# EAGLE design csa_iecuart_v1.1a (EAGLE 6.4)

## Sheet 1 of 3
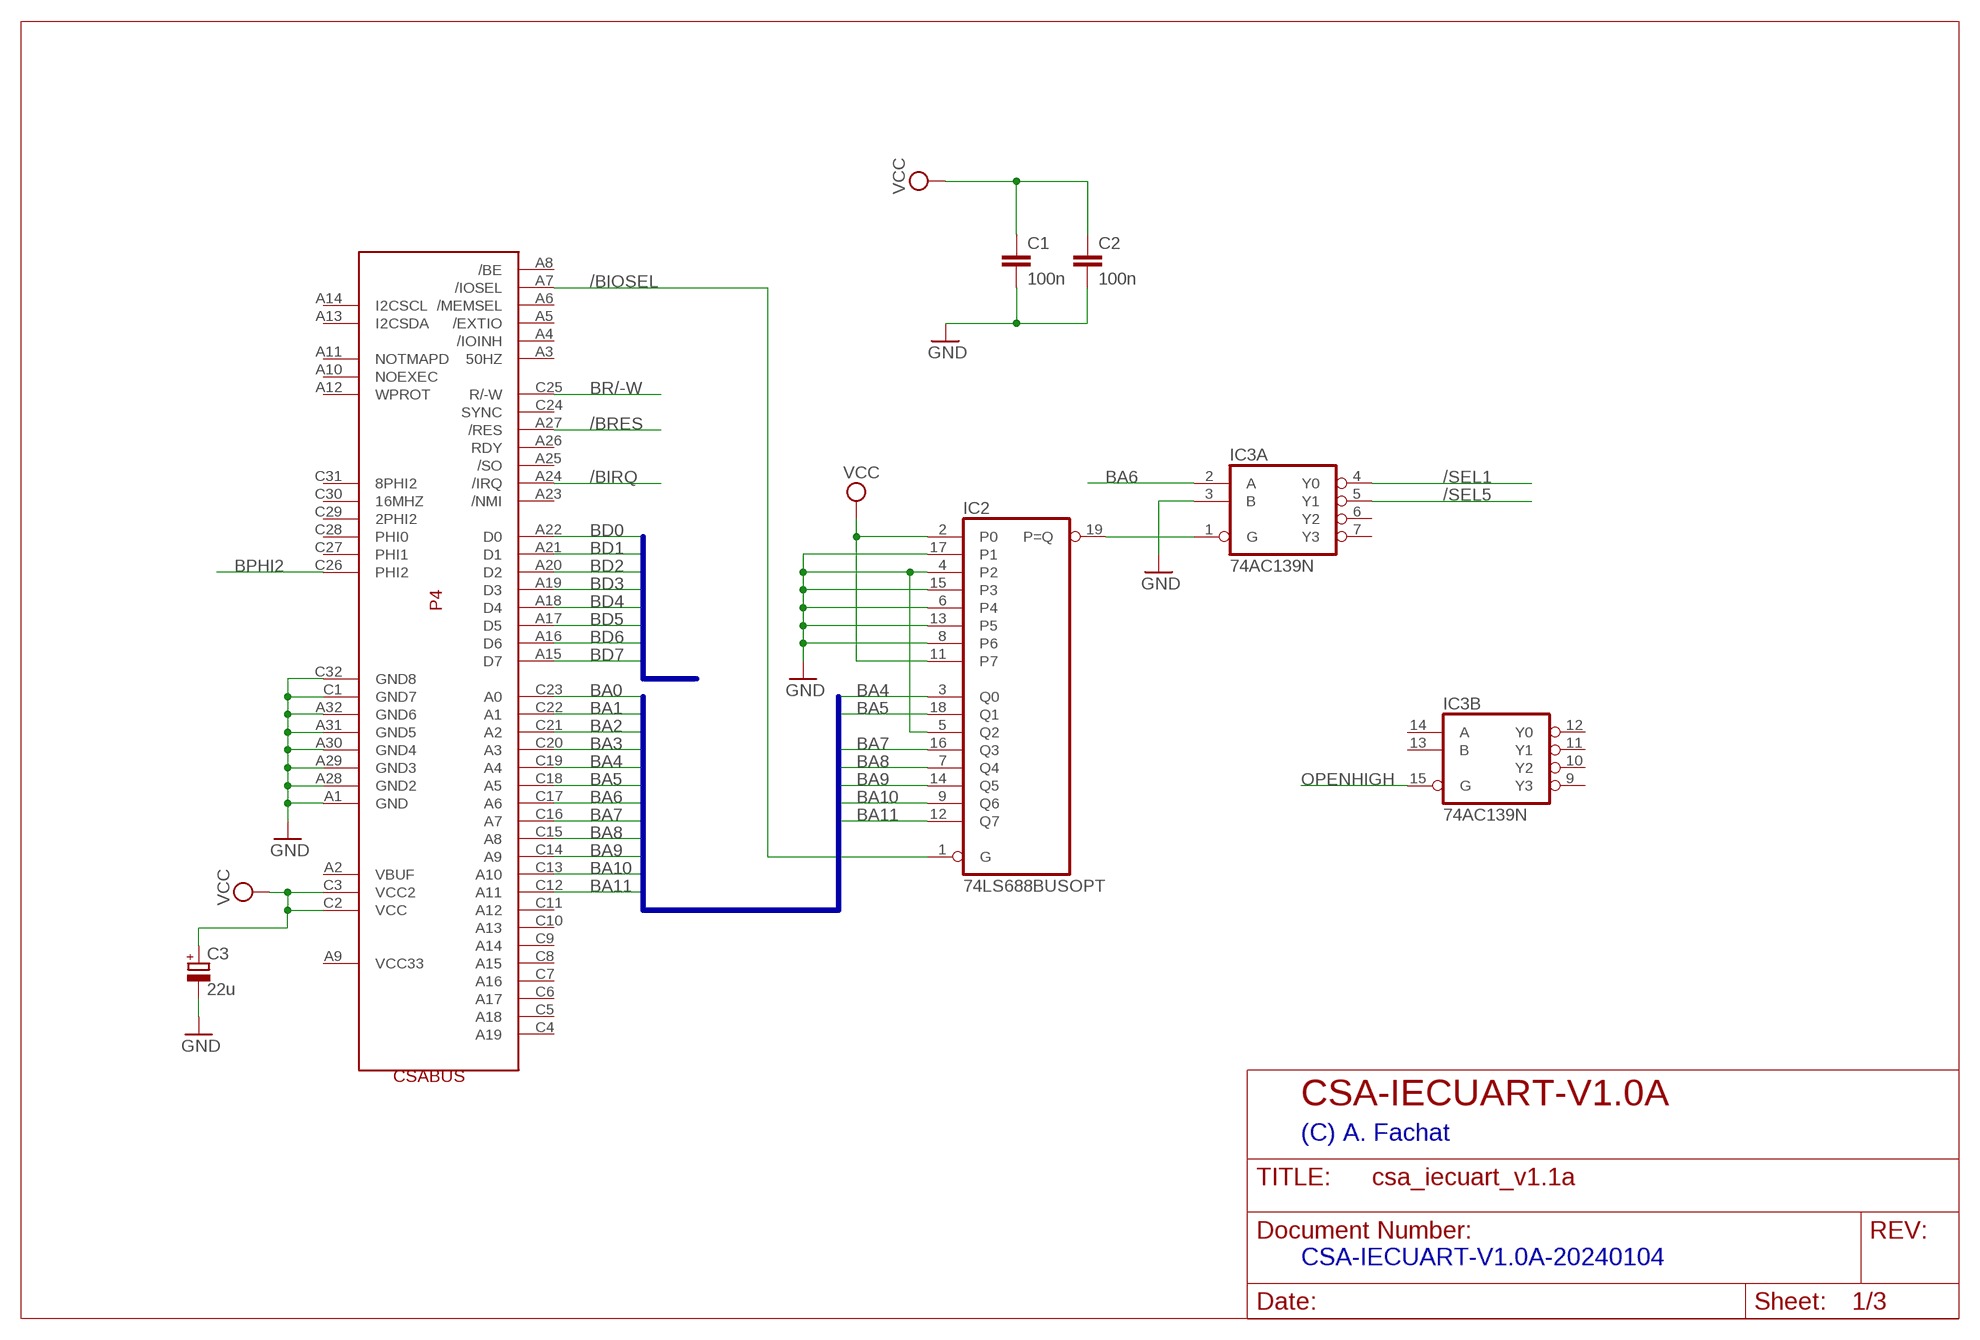
[diagram p0: schematic, sheet 1]

### Parts
C1  100n  C-EU025-024X044  [C025-024X044]
C2  100n  C-EU025-024X044  [C025-024X044]
C3  22u  CPOL-EUE2.5-7  [E2,5-7]
IC2  74LS688BUSOPT  [DIL20]
IC3  74AC139N  [DIL16]
P4  CSABUS  [CSABUS]

### Nets
/BIOSEL: IC2.1(G) P4.A7(/IOSEL)
/BIRQ: P4.A24(/IRQ) ; also sheet 2,3
/BRES: P4.A27(/RES) ; also sheet 2,3
/SEL1: IC3.4(A:Y0) ; also sheet 3
/SEL5: IC3.5(A:Y1) ; also sheet 2
BA0: P4.C23(A0) ; also sheet 2,3
BA1: P4.C22(A1) ; also sheet 2,3
BA2: P4.C21(A2) ; also sheet 2,3
BA3: P4.C20(A3) ; also sheet 2,3
BA4: IC2.3(Q0) P4.C19(A4)
BA5: IC2.18(Q1) P4.C18(A5)
BA6: IC3.2(A:A) P4.C17(A6)
BA7: IC2.16(Q3) P4.C16(A7)
BA8: IC2.7(Q4) P4.C15(A8)
BA9: IC2.14(Q5) P4.C14(A9)
BA10: IC2.9(Q6) P4.C13(A10)
BA11: IC2.12(Q7) P4.C12(A11)
BD0: P4.A22(D0) ; also sheet 2,3
BD1: P4.A21(D1) ; also sheet 2,3
BD2: P4.A20(D2) ; also sheet 2,3
BD3: P4.A19(D3) ; also sheet 2,3
BD4: P4.A18(D4) ; also sheet 2,3
BD5: P4.A17(D5) ; also sheet 2,3
BD6: P4.A16(D6) ; also sheet 2,3
BD7: P4.A15(D7) ; also sheet 2,3
BPHI2: P4.C26(PHI2) ; also sheet 2,3
BR/-W: P4.C25(R/-W) ; also sheet 2,3
GND: C1.2 C2.2 C3.- IC2.4(P2) IC2.5(Q2) IC2.6(P4) IC2.8(P6) IC2.13(P5) IC2.15(P3) IC2.17(P1) IC3.3(A:B) P4.A1(GND) P4.A28(GND2) P4.A29(GND3) P4.A30(GND4) P4.A31(GND5) P4.A32(GND6) P4.C1(GND7) P4.C32(GND8) ; also sheet 2,3
N$3: IC2.19(P=Q) IC3.1(A:G)
OPENHIGH: IC3.15(B:G) ; also sheet 2,3
VCC: C1.1 C2.1 C3.+ IC2.2(P0) IC2.11(P7) P4.C2(VCC) P4.C3(VCC2) ; also sheet 2,3
Unconnected: IC3.6(A:Y2) IC3.7(A:Y3) IC3.9(B:Y3) IC3.10(B:Y2) IC3.11(B:Y1) IC3.12(B:Y0) IC3.13(B:B) IC3.14(B:A) P4.A2(VBUF) P4.A3(50HZ) P4.A4(/IOINH) P4.A5(/EXTIO) P4.A6(/MEMSEL) P4.A8(/BE) P4.A9(VCC33) P4.A10(NOEXEC) P4.A11(NOTMAPD) P4.A12(WPROT) P4.A13(I2CSDA) P4.A14(I2CSCL) P4.A23(/NMI) P4.A25(/SO) P4.A26(RDY) P4.C4(A19) P4.C5(A18) P4.C6(A17) P4.C7(A16) P4.C8(A15) P4.C9(A14) P4.C10(A13) P4.C11(A12) P4.C24(SYNC) P4.C27(PHI1) P4.C28(PHI0) P4.C29(2PHI2) P4.C30(16MHZ) P4.C31(8PHI2)

### Buses
BD[0..7]
BA[0..11]

### Notes on the sheet
- CSA-IECUART-V1.0A
- (C) A. Fachat
- CSA-IECUART-V1.0A-20240104

## Sheet 2 of 3: Fast IEC
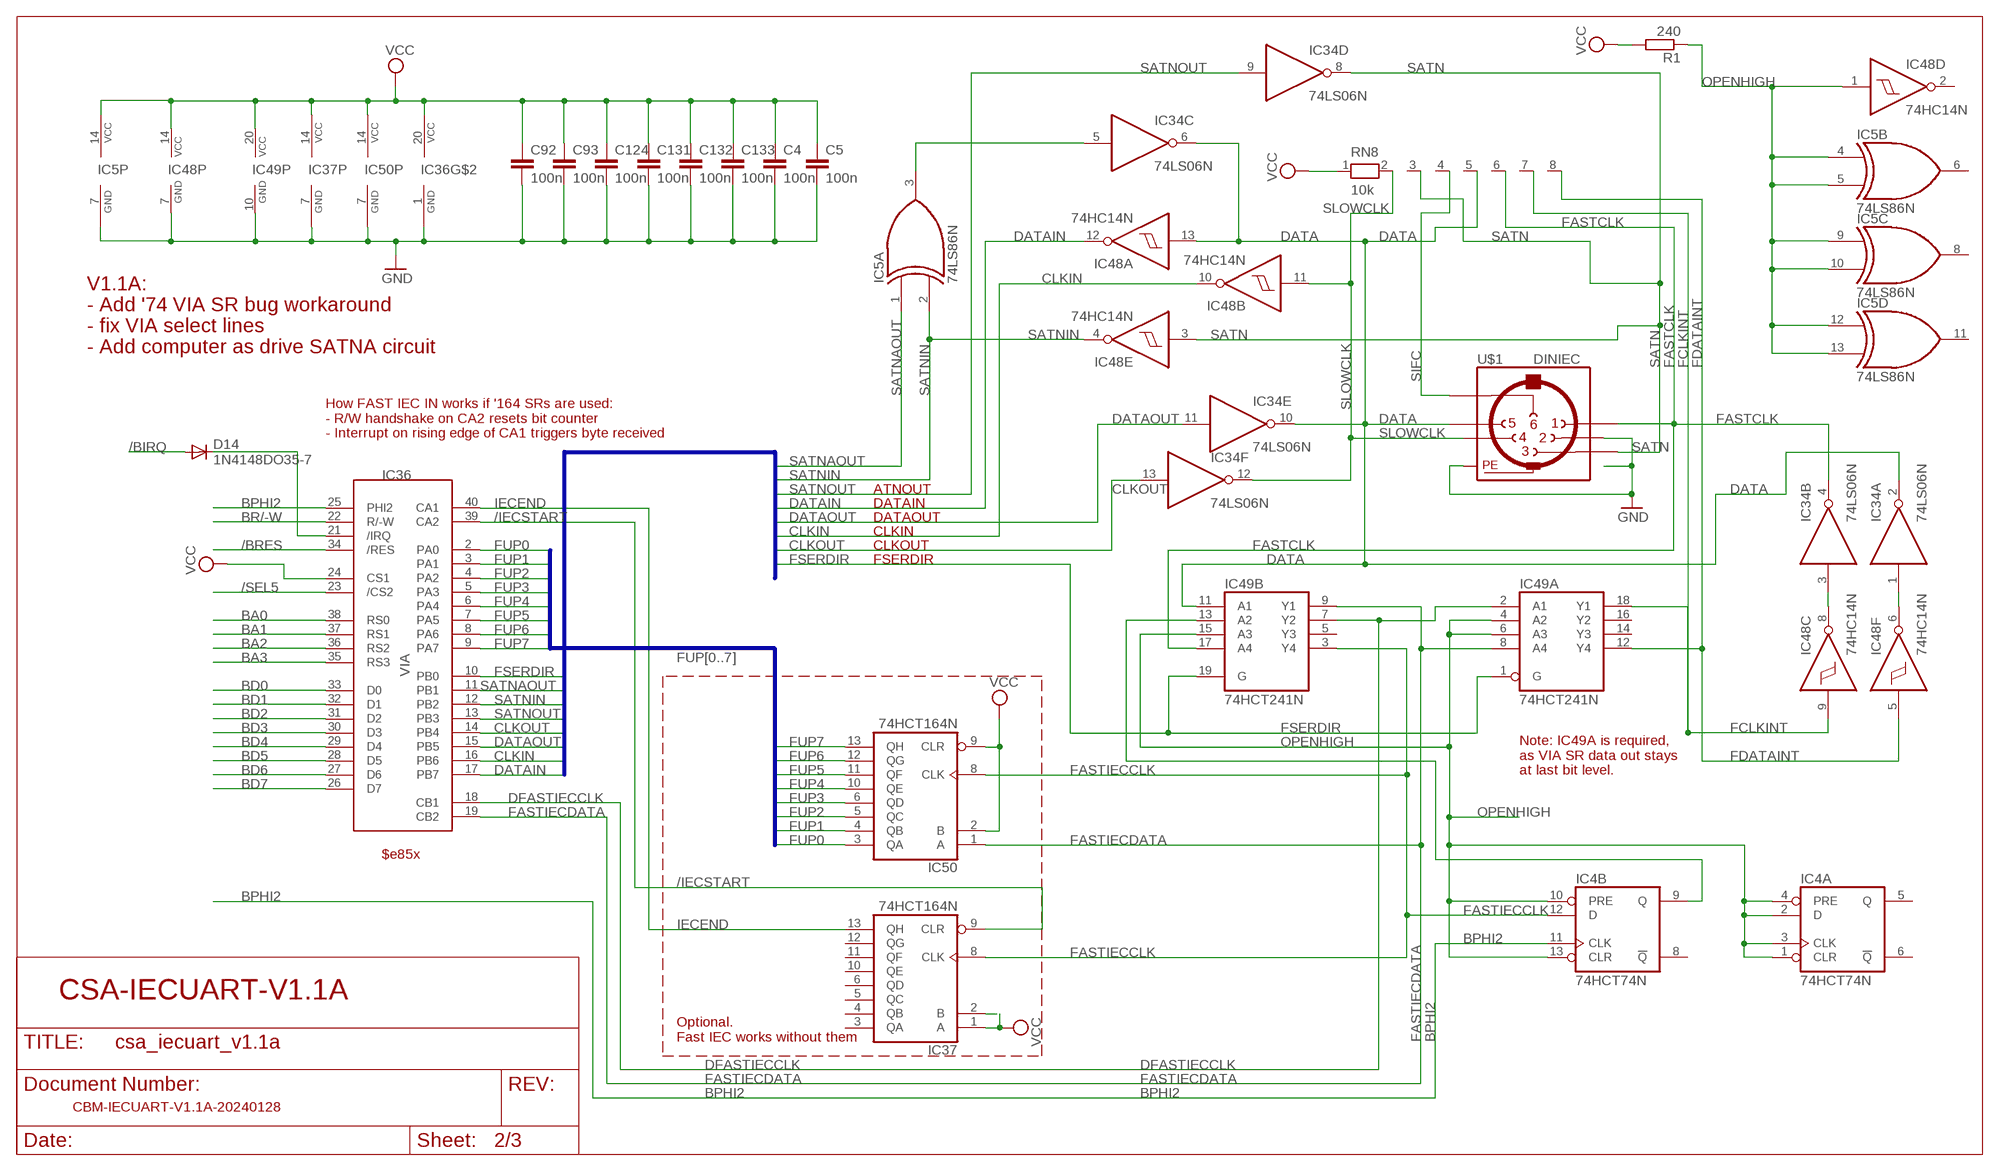
[diagram p1: schematic, sheet 2]

### Parts
C4  100n  C-EU025-024X044  [C025-024X044]
C5  100n  C-EU025-024X044  [C025-024X044]
C92  100n  C-EU025-024X044  [C025-024X044]
C93  100n  C-EU025-024X044  [C025-024X044]
C124  100n  C-EU025-024X044  [C025-024X044]
C131  100n  C-EU025-024X044  [C025-024X044]
C132  100n  C-EU025-024X044  [C025-024X044]
C133  100n  C-EU025-024X044  [C025-024X044]
D14  1N4148DO35-7  [DO35-7]
IC4  74HCT74N  [DIL14]
IC5  74LS86N  [DIL14]
IC34  74LS06N  [DIL14]
IC36  VIA  [DIL40]
IC37  74HCT164N  [DIL14]
IC48  74HC14N  [DIL14]
IC49  74HCT241N  [DIL20]
IC50  74HCT164N  [DIL14]
R1  240  R-EU_0207/10  [0207/10]
RN8  10k  RN07  [RN-8]
U$1  DINIEC  [DIN6PIEC]

### Nets
/BIRQ: D14.A ; also sheet 1,3
/BRES: IC36.34(/RES) ; also sheet 1,3
/IECSTART: IC36.39(CA2) IC37.9(CLR)
/SEL5: IC36.23(/CS2) ; also sheet 1
BA0: IC36.38(RS0) ; also sheet 1,3
BA1: IC36.37(RS1) ; also sheet 1,3
BA2: IC36.36(RS2) ; also sheet 1,3
BA3: IC36.35(RS3) ; also sheet 1,3
BD0: IC36.33(D0) ; also sheet 1,3
BD1: IC36.32(D1) ; also sheet 1,3
BD2: IC36.31(D2) ; also sheet 1,3
BD3: IC36.30(D3) ; also sheet 1,3
BD4: IC36.29(D4) ; also sheet 1,3
BD5: IC36.28(D5) ; also sheet 1,3
BD6: IC36.27(D6) ; also sheet 1,3
BD7: IC36.26(D7) ; also sheet 1,3
BPHI2: IC4.11(B:CLK) IC36.25(PHI2) ; also sheet 1,3
BR/-W: IC36.22(R/-W) ; also sheet 1,3
CLKIN: IC36.16(PB6) IC48.10(B:O)
CLKOUT: IC34.13(F:I) IC36.14(PB4)
DATA: IC34.2(A:O) IC34.6(C:O) IC34.10(E:O) IC48.13(A:I) IC49.11(B:A1) RN8.5 U$1.5
DATAIN: IC36.17(PB7) IC48.12(A:O)
DATAOUT: IC34.11(E:I) IC36.15(PB5)
DFASTIECCLK: IC36.18(CB1) IC49.2(A:A1) IC49.7(B:Y2)
FASTCLK: IC34.4(B:O) IC49.17(B:A4) RN8.6 U$1.1
FASTIECCLK: IC4.12(B:D) IC37.8(CLK) IC49.3(B:Y4) IC50.8(CLK)
FASTIECDATA: IC36.19(CB2) IC49.8(A:A4) IC49.9(B:Y1) IC50.1(A)
FCLKINT: IC48.9(C:I) IC49.18(A:Y1) RN8.7
FDATAINT: IC48.5(F:I) IC49.12(A:Y4) RN8.8
FSERDIR: IC36.10(PB0) IC49.1(A:G) IC49.19(B:G)
FUP0: IC36.2(PA0) IC50.3(QA)
FUP1: IC36.3(PA1) IC50.4(QB)
FUP2: IC36.4(PA2) IC50.5(QC)
FUP3: IC36.5(PA3) IC50.6(QD)
FUP4: IC36.6(PA4) IC50.10(QE)
FUP5: IC36.7(PA5) IC50.11(QF)
FUP6: IC36.8(PA6) IC50.12(QG)
FUP7: IC36.9(PA7) IC50.13(QH)
GND: C4.2 C5.2 C92.2 C93.2 C124.2 C131.2 C132.2 C133.2 IC5.7(P:GND) IC36.1(GND) IC37.7(GND) IC48.7(P:GND) IC49.10(P:GND) IC50.7(GND) U$1.2 U$1.PE U$1.PE@1(PE) U$1.PE@2(PE) U$1.PE@(PE) ; also sheet 1,3
IECEND: IC36.40(CA1) IC37.13(QH)
N$1: IC34.1(A:I) IC48.6(F:O)
N$2: IC34.3(B:I) IC48.8(C:O)
N$4: IC4.9(B:Q) IC49.13(B:A2)
N$5: IC5.3(A:O) IC34.5(C:I)
N$122: D14.C IC36.21(/IRQ)
OPENHIGH: IC4.1(A:CLR) IC4.2(A:D) IC4.3(A:CLK) IC4.4(A:PRE) IC4.10(B:PRE) IC4.13(B:CLR) IC5.4(B:I0) IC5.5(B:I1) IC5.9(C:I0) IC5.10(C:I1) IC5.12(D:I0) IC5.13(D:I1) IC48.1(D:I) IC49.4(A:A2) IC49.6(A:A3) IC49.15(B:A3) R1.1 ; also sheet 1,3
SATN: IC34.8(D:O) IC48.3(E:I) RN8.3 U$1.3
SATNAOUT: IC5.1(A:I0) IC36.11(PB1)
SATNIN: IC5.2(A:I1) IC36.12(PB2) IC48.4(E:O)
SATNOUT: IC34.9(D:I) IC36.13(PB3)
SIFC: RN8.4 U$1.6
SLOWCLK: IC34.12(F:O) IC48.11(B:I) RN8.2 U$1.4
VCC: C4.1 C5.1 C92.1 C93.1 C124.1 C131.1 C132.1 C133.1 IC5.14(P:VCC) IC36.20(VCC) IC36.24(CS1) IC37.1(A) IC37.2(B) IC37.14(VCC) IC48.14(P:VCC) IC49.20(P:VCC) IC50.2(B) IC50.9(CLR) IC50.14(VCC) R1.2 RN8.1 ; also sheet 1,3
Unconnected: IC4.5(A:Q) IC4.6(A:!Q) IC4.8(B:!Q) IC5.6(B:O) IC5.8(C:O) IC5.11(D:O) IC37.3(QA) IC37.4(QB) IC37.5(QC) IC37.6(QD) IC37.10(QE) IC37.11(QF) IC37.12(QG) IC48.2(D:O) IC49.5(B:Y3) IC49.14(A:Y3) IC49.16(A:Y2)

### Buses
SATNOUT,DATAIN,DATAOUT,CLKIN,CLKOUT,FSERDIR,SATNIN,SATNAOUT
FUP[0..7]

### Notes on the sheet
- V1.1A:
  - Add '74 VIA SR bug workaround
  - fix VIA select lines
  - Add computer as drive SATNA circuit
- How FAST IEC IN works if '164 SRs are used:
  - R/W handshake on CA2 resets bit counter
  - Interrupt on rising edge of CA1 triggers byte received
- ATNOUT
- DATAIN
- DATAOUT
- CLKIN
- CLKOUT
- FSERDIR
- Note: IC49A is required,
  as VIA SR data out stays
  at last bit level.
- $e85x
- CSA-IECUART-V1.1A
- Optional.
  Fast IEC works without them
- CBM-IECUART-V1.1A-20240128

## Sheet 3 of 3: UART
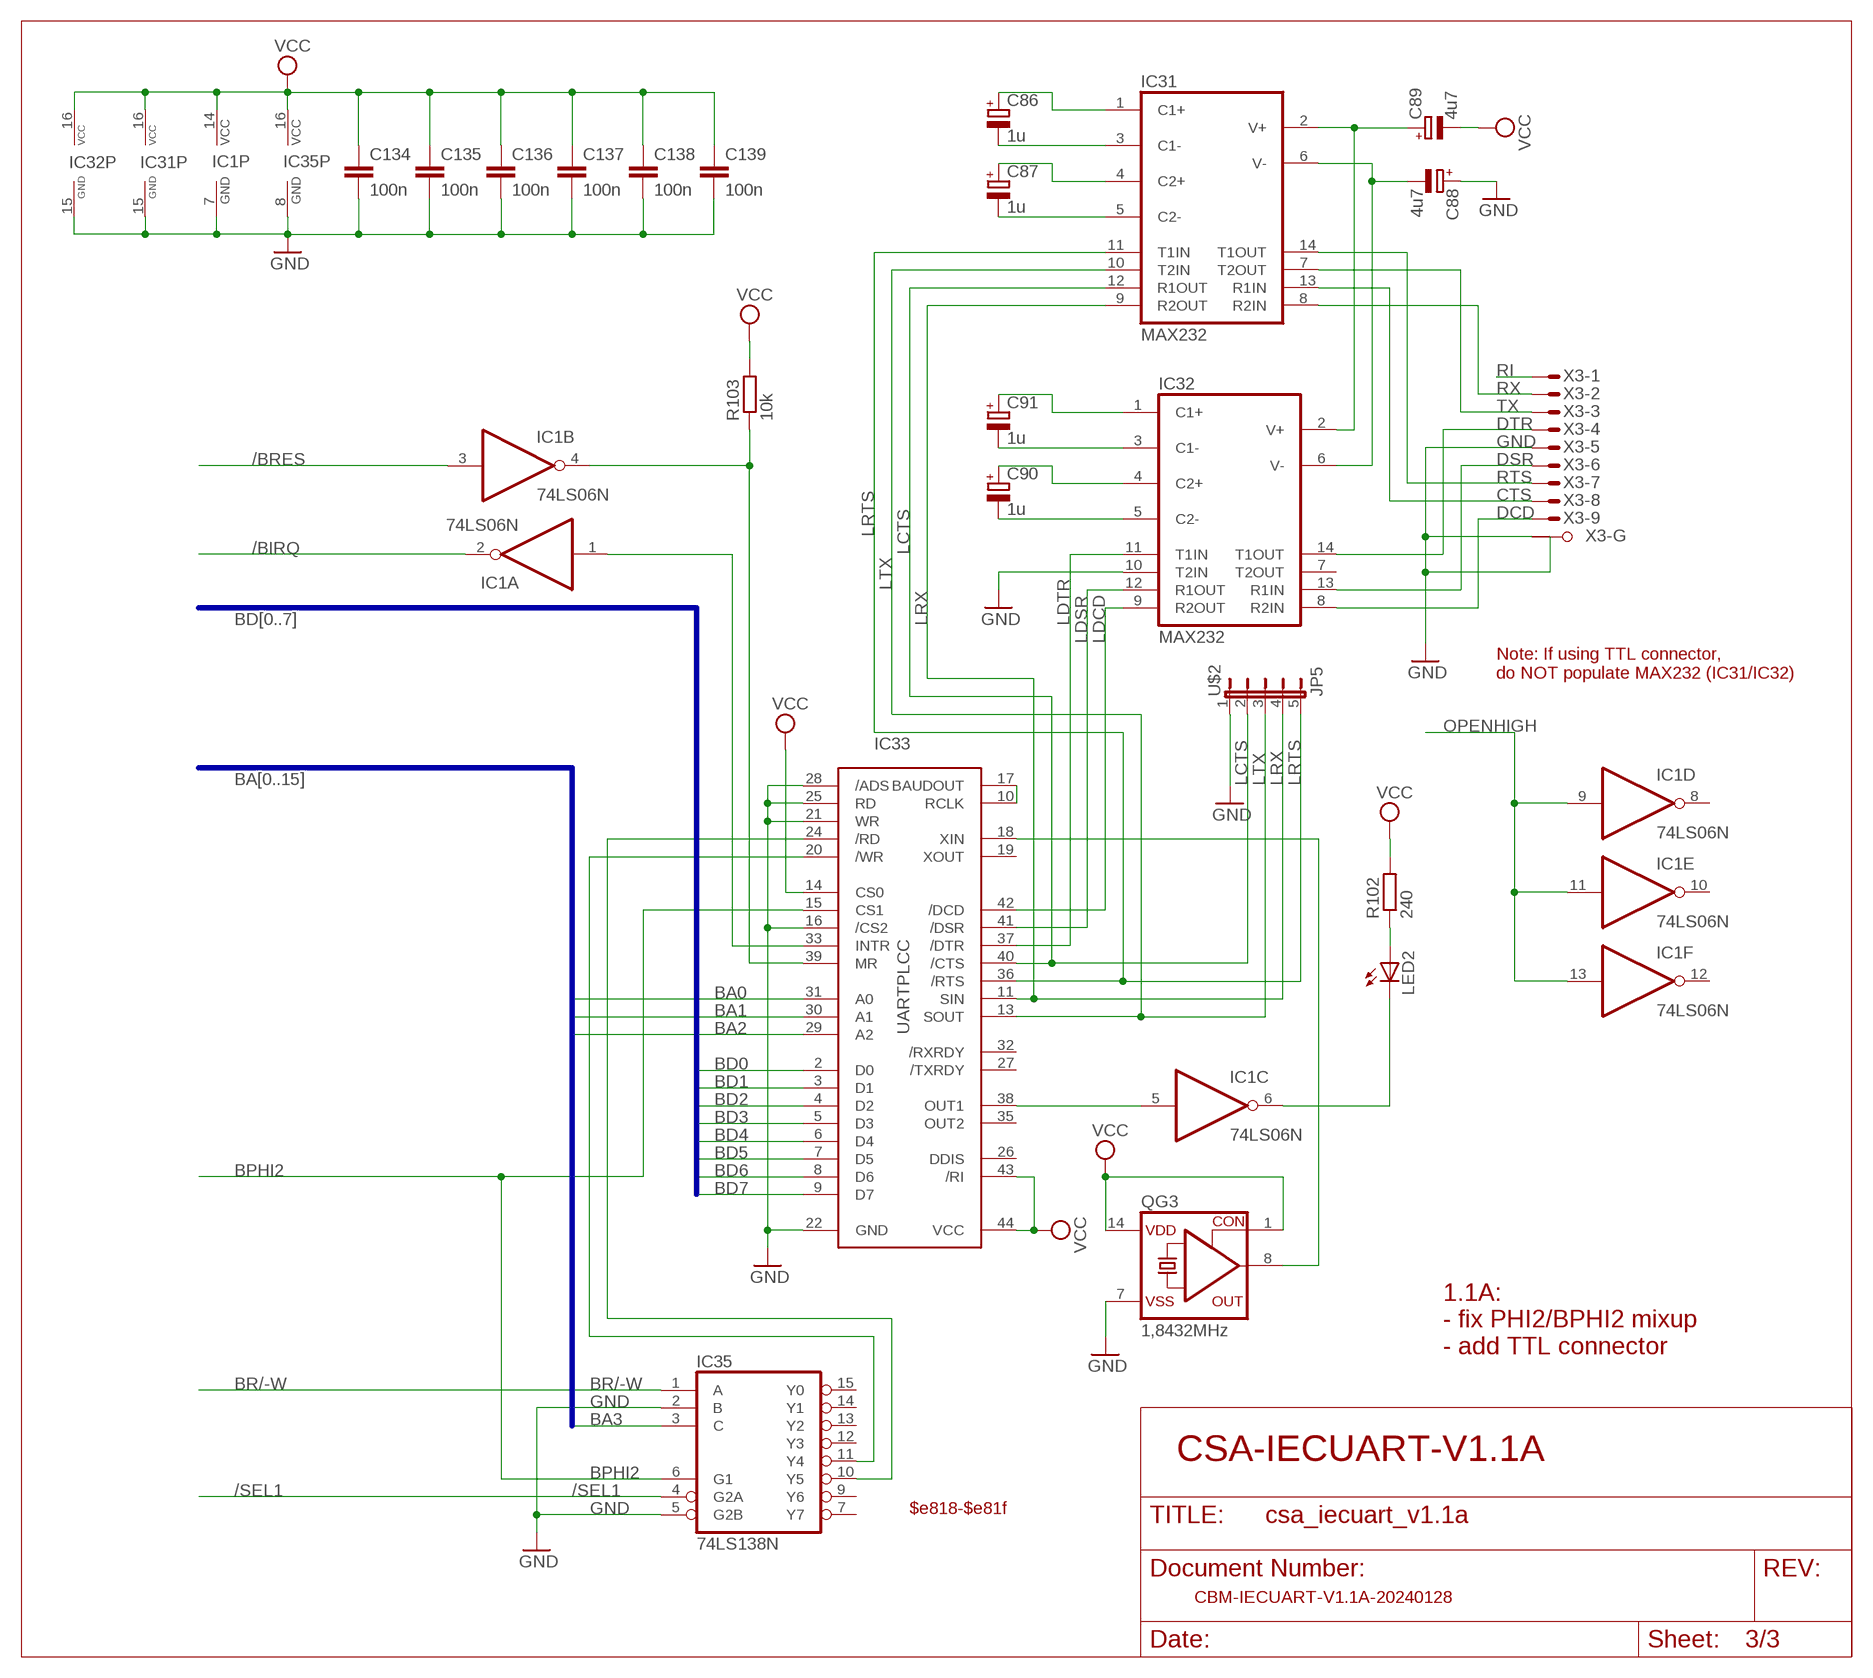
[diagram p2: schematic, sheet 3]

### Parts
C86  1u  CPOL-EUE2.5-6  [E2,5-6]
C87  1u  CPOL-EUE2.5-6  [E2,5-6]
C88  4u7  CPOL-EUE2.5-6  [E2,5-6]
C89  4u7  CPOL-EUE2.5-6  [E2,5-6]
C90  1u  CPOL-EUE2.5-6  [E2,5-6]
C91  1u  CPOL-EUE2.5-6  [E2,5-6]
C134  100n  C-EU025-024X044  [C025-024X044]
C135  100n  C-EU025-024X044  [C025-024X044]
C136  100n  C-EU025-024X044  [C025-024X044]
C137  100n  C-EU025-024X044  [C025-024X044]
C138  100n  C-EU025-024X044  [C025-024X044]
C139  100n  C-EU025-024X044  [C025-024X044]
IC1  74LS06N  [DIL14]
IC31  MAX232  [DIL16]
IC32  MAX232  [DIL16]
IC33  UARTPLCC  [PLCC44]
IC35  74LS138N  [DIL16]
LED2  LED3MM  [LED3MM]
QG3  1,8432MHz  CRYSTAL_RES-SG51  [SG51]
R102  240  R-EU_0207/10  [0207/10]
R103  10k  R-EU_0207/10  [0207/10]
U$2  JP5  [JP5]
X3  M09HPS  [M09HP]

### Nets
/BIRQ: IC1.2(A:O) ; also sheet 1,2
/BRES: IC1.3(B:I) ; also sheet 1,2
/SEL1: IC35.4(G2A) ; also sheet 1
BA0: IC33.31(A0) ; also sheet 1,2
BA1: IC33.30(A1) ; also sheet 1,2
BA2: IC33.29(A2) ; also sheet 1,2
BA3: IC35.3(C) ; also sheet 1,2
BD0: IC33.2(D0) ; also sheet 1,2
BD1: IC33.3(D1) ; also sheet 1,2
BD2: IC33.4(D2) ; also sheet 1,2
BD3: IC33.5(D3) ; also sheet 1,2
BD4: IC33.6(D4) ; also sheet 1,2
BD5: IC33.7(D5) ; also sheet 1,2
BD6: IC33.8(D6) ; also sheet 1,2
BD7: IC33.9(D7) ; also sheet 1,2
BPHI2: IC33.15(CS1) IC35.6(G1) ; also sheet 1,2
BR/-W: IC35.1(A) ; also sheet 1,2
CTS: IC31.13(R1IN) X3.8(-8:M)
DCD: IC32.8(R2IN) X3.9(-9:M)
DSR: IC32.13(R1IN) X3.6(-6:M)
DTR: IC32.14(T1OUT) X3.4(-4:M)
GND: C88.+ C134.2 C135.2 C136.2 C137.2 C138.2 C139.2 IC1.7(P:GND) IC31.15(GND) IC32.10(T2IN) IC32.15(GND) IC33.16(/CS2) IC33.21(WR) IC33.22(GND) IC33.25(RD) IC33.28(/ADS) IC35.2(B) IC35.5(G2B) IC35.8(GND) QG3.7(VSS) U$2.1 X3.5(-5:M) X3.G1(-G:G1) X3.G2(-G:G2) ; also sheet 1,2
LCTS: IC31.12(R1OUT) IC33.40(/CTS) U$2.2
LDCD: IC32.9(R2OUT) IC33.42(/DCD)
LDSR: IC32.12(R1OUT) IC33.41(/DSR)
LDTR: IC32.11(T1IN) IC33.37(/DTR)
LRTS: IC31.11(T1IN) IC33.36(/RTS) U$2.5
LRX: IC31.9(R2OUT) IC33.11(SIN) U$2.4
LTX: IC31.10(T2IN) IC33.13(SOUT) U$2.3
N$11: IC33.18(XIN) QG3.8(OUT)
N$112: C86.- IC31.3(C1-)
N$118: C86.+ IC31.1(C1+)
N$149: C91.- IC32.3(C1-)
N$150: C91.+ IC32.1(C1+)
N$151: C87.- IC31.5(C2-)
N$152: C87.+ IC31.4(C2+)
N$153: C90.- IC32.5(C2-)
N$154: C90.+ IC32.4(C2+)
N$155: C88.- IC31.6(V-) IC32.6(V-)
N$156: C89.+ IC31.2(V+) IC32.2(V+)
N$157: IC33.10(RCLK) IC33.17(BAUDOUT)
N$158: IC1.1(A:I) IC33.33(INTR)
N$159: IC33.20(/WR) IC35.11(Y4)
N$160: IC33.24(/RD) IC35.10(Y5)
N$162: LED2.A R102.1
N$163: IC1.5(C:I) IC33.38(OUT1)
N$164: IC1.6(C:O) LED2.K(C)
OPENHIGH: IC1.9(D:I) IC1.11(E:I) IC1.13(F:I) ; also sheet 1,2
RI: X3.1(-1:M)
RTS: IC31.14(T1OUT) X3.7(-7:M)
RX: IC31.8(R2IN) X3.2(-2:M)
TX: IC31.7(T2OUT) X3.3(-3:M)
UARTRES: IC1.4(B:O) IC33.39(MR) R103.1
VCC: C89.- C134.1 C135.1 C136.1 C137.1 C138.1 C139.1 IC1.14(P:VCC) IC31.16(VCC) IC32.16(VCC) IC33.14(CS0) IC33.43(/RI) IC33.44(VCC) IC35.16(VCC) QG3.1(CON) QG3.14(VDD) R102.2 R103.2 ; also sheet 1,2
Unconnected: IC1.8(D:O) IC1.10(E:O) IC1.12(F:O) IC32.7(T2OUT) IC33.19(XOUT) IC33.26(DDIS) IC33.27(/TXRDY) IC33.32(/RXRDY) IC33.35(OUT2) IC35.7(Y7) IC35.9(Y6) IC35.12(Y3) IC35.13(Y2) IC35.14(Y1) IC35.15(Y0)

### Buses
BA[0..15]
BD[0..7]

### Notes on the sheet
- Note: If using TTL connector,
  do NOT populate MAX232 (IC31/IC32)
- 1.1A:
  - fix PHI2/BPHI2 mixup
  - add TTL connector
- CSA-IECUART-V1.1A
- $e818-$e81f
- CBM-IECUART-V1.1A-20240128

## Power pins joined to a net without a drawn wire
GND: IC2.10(GND) IC3.8(P:GND) IC4.7(P:GND) IC34.7(P:GND)
VCC: IC2.20(VCC) IC3.16(P:VCC) IC4.14(P:VCC) IC34.14(P:VCC)

## Library data of the parts
C1 C2 C4 C5 C92 C93 C124 C131-C139 = rcl:C-EU: CAPACITOR, European symbol
C3 = resistor:CPOL-EU: POLARIZED CAPACITOR, European symbol
C86-C91 = rcl:CPOL-EU: POLARIZED CAPACITOR, European symbol
D14 = diode:1N4148: DIODE high speed (Philips)
IC1 IC34 = 74xx-eu:74*06: Hex INVERTER, open collector high-voltage output
IC2 = csa:74LS688BUSOPT
IC3 = 74xx-eu:74*139: Dual 2-line to 4-line DECODER/DEMULTIPLEXER
IC4 = 74xx-eu:74*74: Dual D type positive edge triggered FLIP FLOP, preset and clear
IC5 = 74xx-us:74*86: Quad 2-input EXCLUSIV-OR (XOR) gate
IC31 IC32 = maxim:MAX232: RS232 TRANSEIVER
IC33 = csa:UART
IC35 = 74xx-eu:74*138: 3-line to 8-line DECODER/DEMULTIPLEXER
IC36 = csa:VIA
IC37 IC50 = 74xx-us:74*164: 8-bit parallel out SHIFT REGISTER
IC48 = 74xx-eu:74*14: Hex schmitt trigger INVERTER
IC49 = 74xx-eu:74*241: Octal BUFFER and LINE DRIVER, 3-state
LED2 = led:LED: LED OSRAM: - CHIPLED LG R971, LG N971, LY N971, LG Q971, LY Q971, LO R971, LY R971 LH N974, LH R974 LS Q976, LO Q976, LY Q976 LO Q996 - Hyper CHIPLED LW Q18S LB Q993, LB Q99A, LB R99A - SideLED LS A670, LO A670, LY A670, LG A670, LP A670 LB A673, LV A673, LT A673, LW A673 LH A674 LY A675 LS A676, LA A676, LO A676, LY A676, LW A676 LS A679, LY A679, LG A679 - Hyper Micro SIDELED® LS Y876, LA Y876, LO Y876, LY Y876 LT Y87S - SmartLED LW L88C, LW L88S LB L89C, LB L89S, LG L890 LS L89K, LO L89K, LY L89K LS L896, LA L896, LO L896, LY L896 - TOPLED LS T670, LO T670, LY T670, LG T670, LP T670 LSG T670, LSP T670, LSY T670, LOP T670, LYG T670 LG T671, LOG T671, LSG T671 LB T673, LV T673, LT T673, LW T673 LH T674 LS T676, LA T676, LO T676, LY T676, LB T676, LH T676, LSB T676, LW T676 LB T67C, LV T67C, LT T67C, LS T67K, LO T67K, LY T67K, LW E67C LS E67B, LA E67B, LO E67B, LY E67B, LB E67C, LV E67C, LT E67C LW T67C LS T679, LY T679, LG T679 LS T770, LO T770, LY T770, LG T770, LP T770 LB T773, LV T773, LT T773, LW T773 LH T774 LS E675, LA E675, LY E675, LS T675 LS T776, LA T776, LO T776, LY T776, LB T776 LHGB T686 LT T68C, LB T68C - Hyper Mini TOPLED® LB M676 - Mini TOPLED Santana® LG M470 LS M47K, LO M47K, LY M47K Source: http://www.osram.convergy.de LUXEON: - LUMILED® LXK2-PW12-R00, LXK2-PW12-S00, LXK2-PW14-U00, LXK2-PW14-V00 LXK2-PM12-R00, LXK2-PM12-S00, LXK2-PM14-U00 LXK2-PE12-Q00, LXK2-PE12-R00, LXK2-PE12-S00, LXK2-PE14-T00, LXK2-PE14-U00 LXK2-PB12-K00, LXK2-PB12-L00, LXK2-PB12-M00, LXK2-PB14-N00, LXK2-PB14-P00, LXK2-PB14-Q00 LXK2-PR12-L00, LXK2-PR12-M00, LXK2-PR14-Q00, LXK2-PR14-R00 LXK2-PD12-Q00, LXK2-PD12-R00, LXK2-PD12-S00 LXK2-PH12-R00, LXK2-PH12-S00 LXK2-PL12-P00, LXK2-PL12-Q00, LXK2-PL12-R00 Source: www.luxeon.com KINGBRIGHT: KA-3528ASYC Source: www.kingbright.com
P4 = csa:CSABUS
QG3 = crystal:CRYSTAL_RES-: CRYSTAL RESONATOR
R1 R102 R103 = rcl:R-EU_: RESISTOR, European symbol
RN8 = resistor-net:RN07: RESISTOR NETWORK
U$1 = csa:DINIEC
U$2 = csa:JP5
X3 = con-subd:M09HPS: SUB-D

## Net classes
0 default: clearance 0.152 mm

## Board
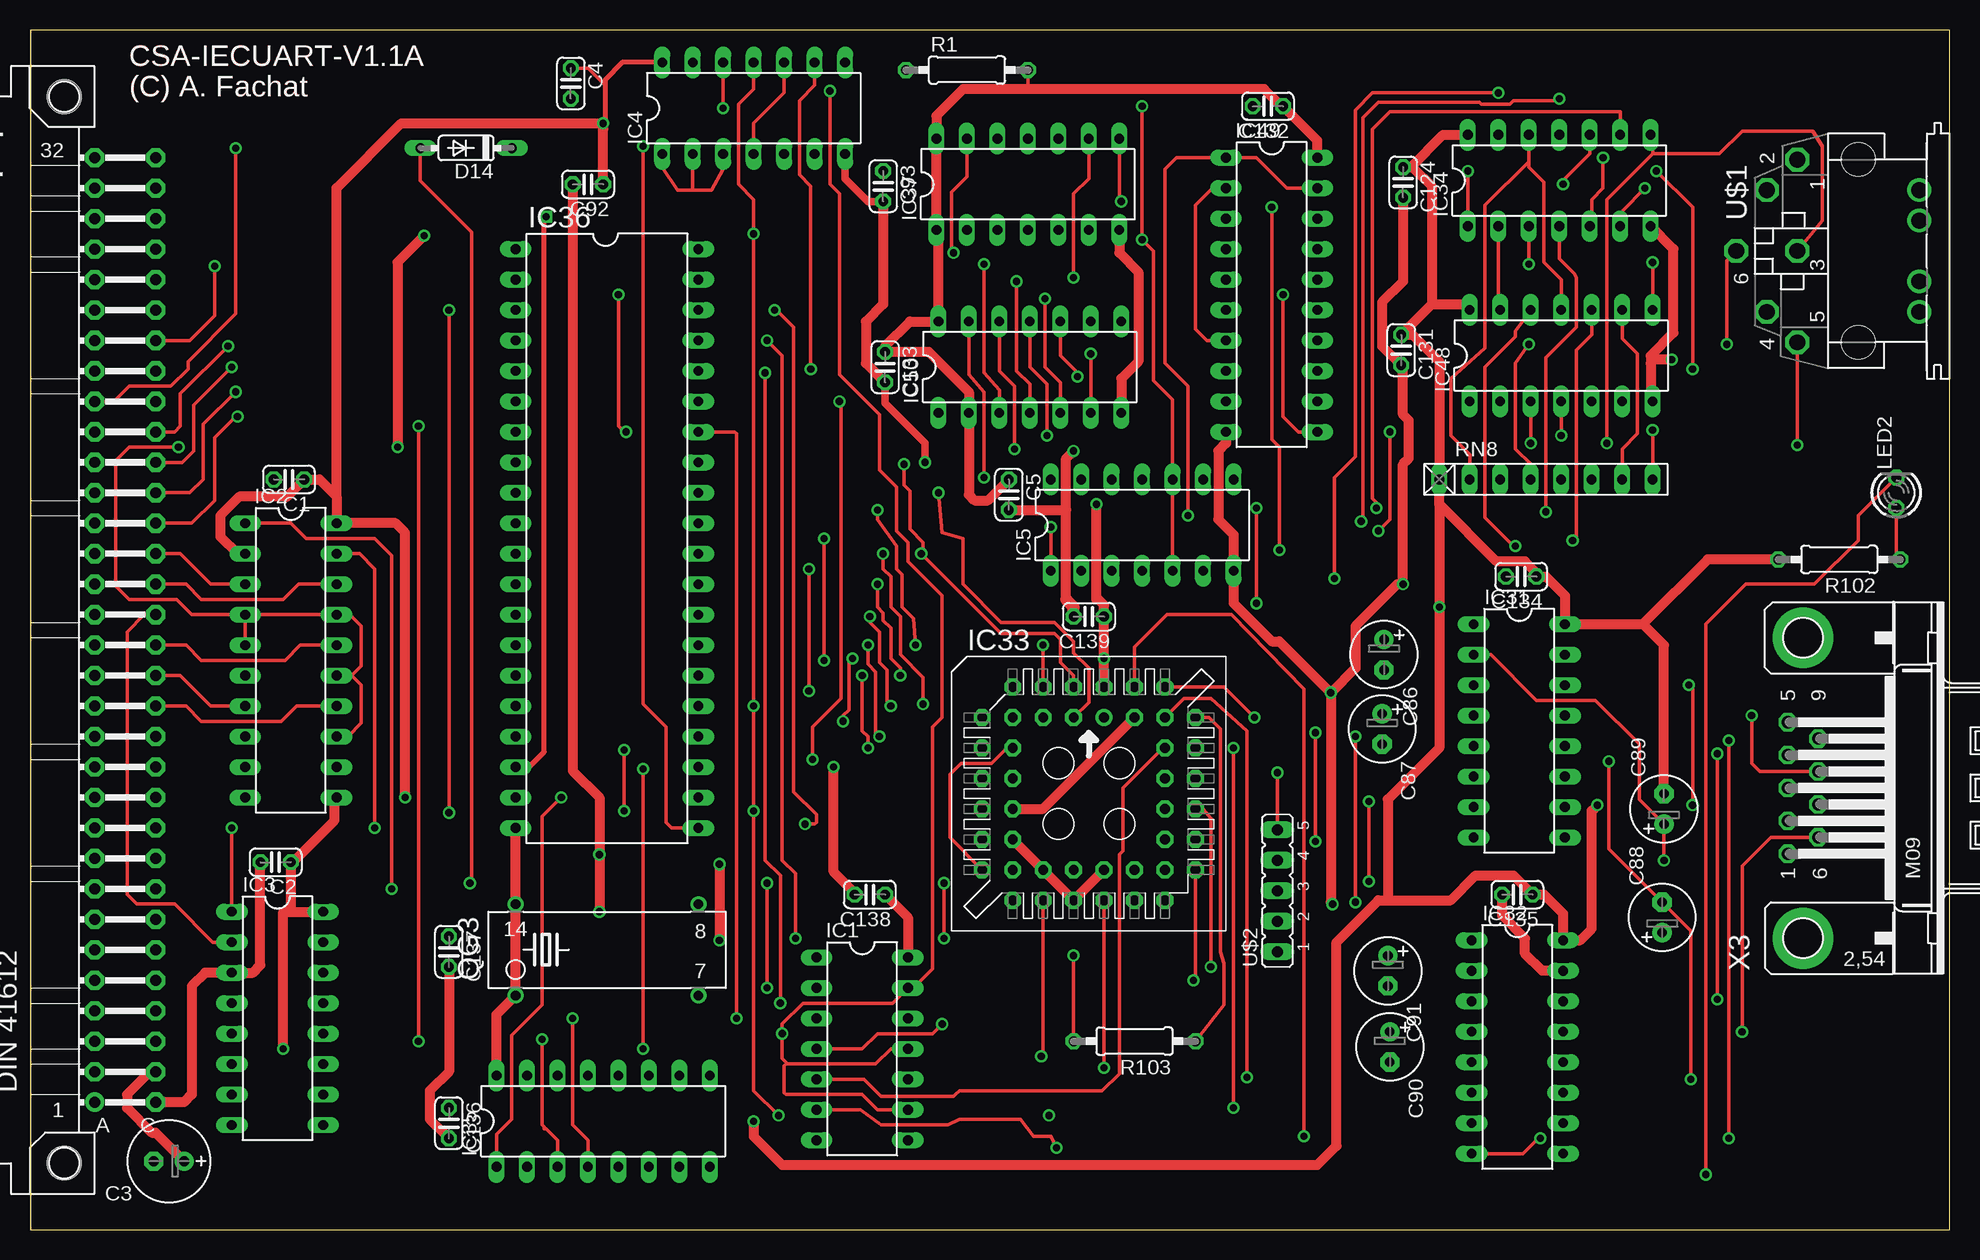
[diagram p3: board, top side]
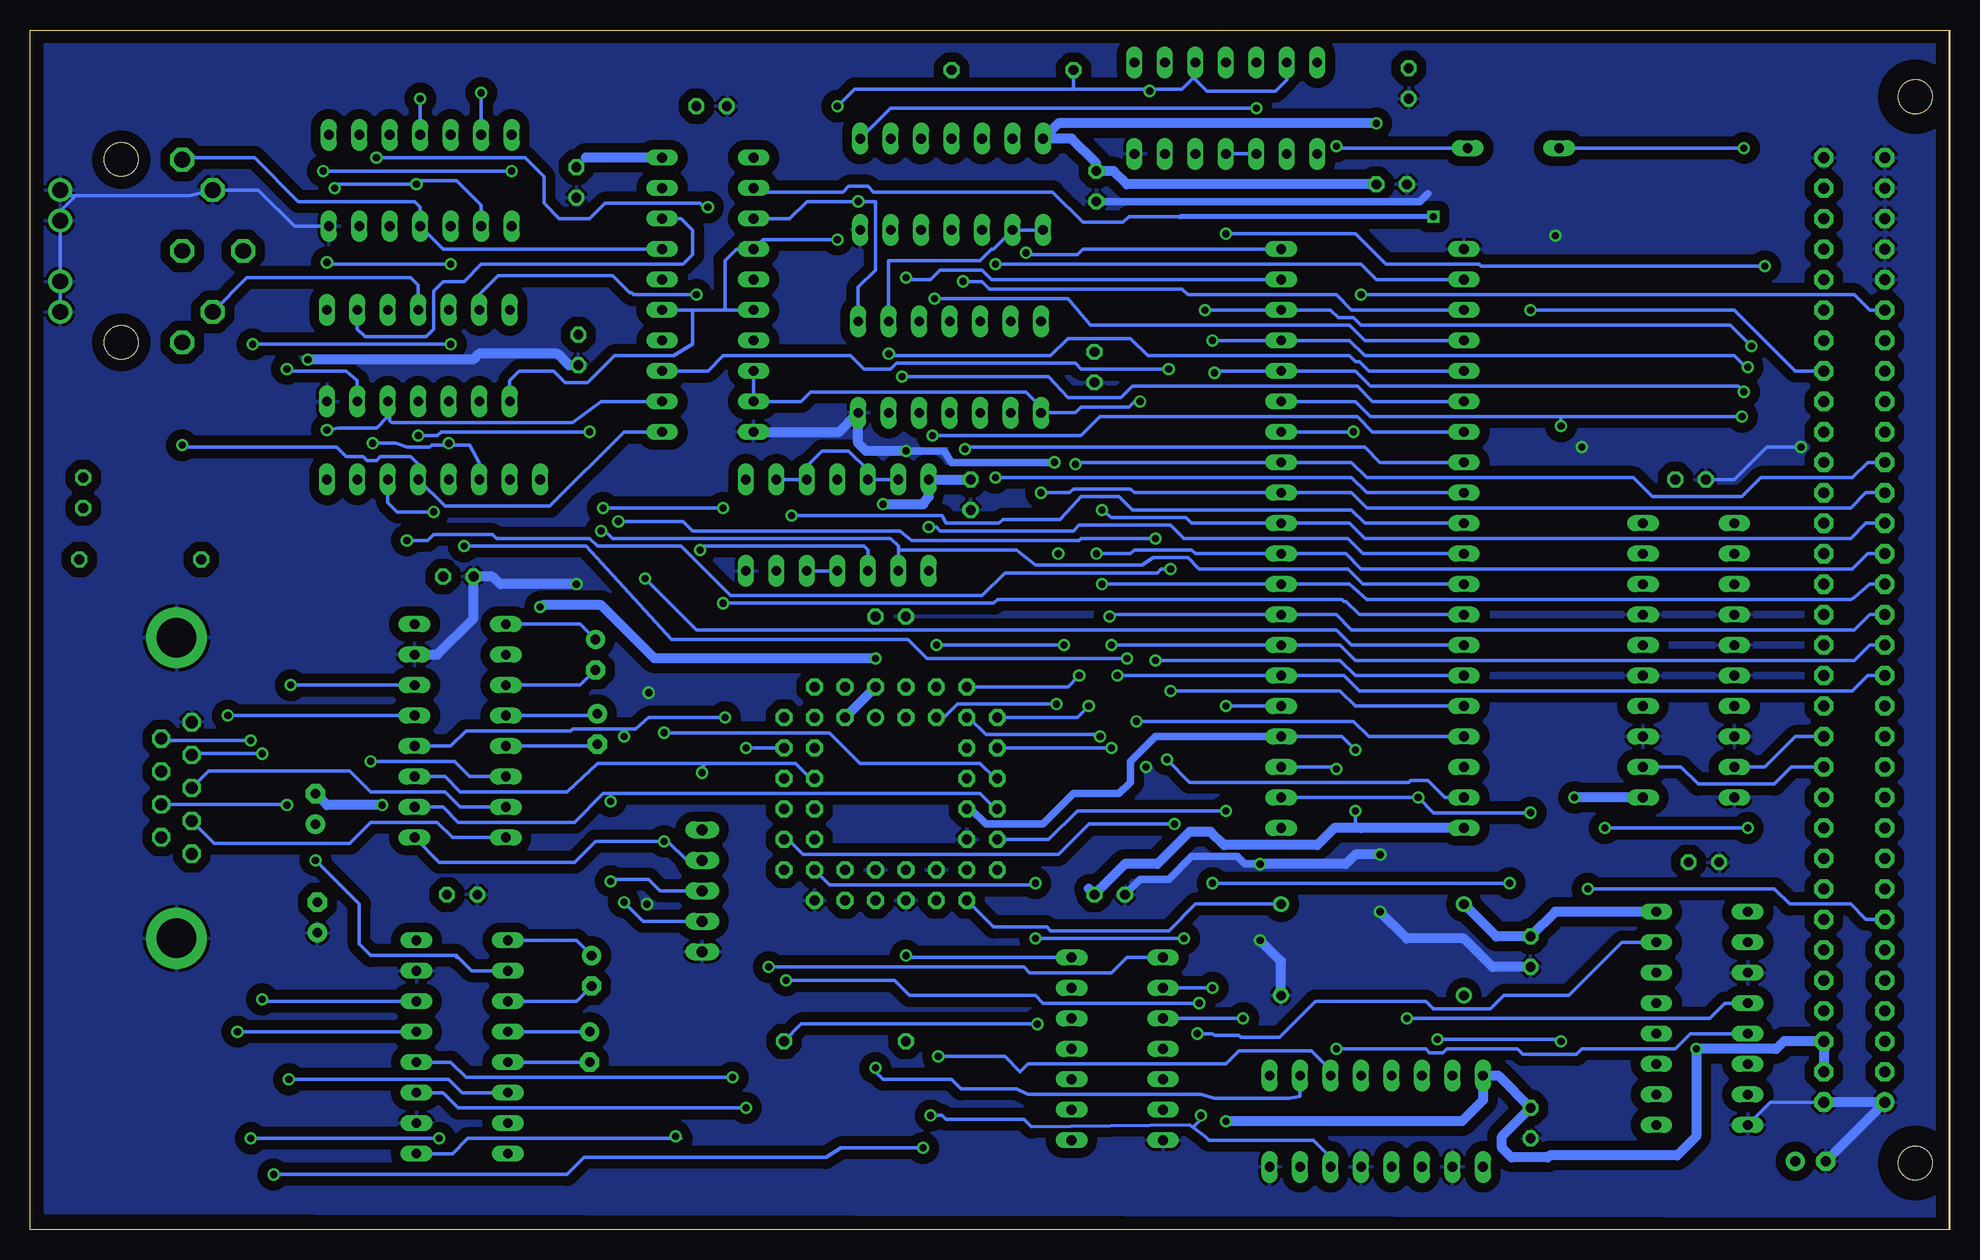
[diagram p4: board, bottom side, seen from below]

Size 160 x 100.03 mm. Coordinates in mm from the lower left corner, seen from the top.
Outline: 0,0.01 160,0.01 160,100.01 0,100.01 0,0.01
Copper layers (1*16): Top 0.035mm / dielectric 1.5mm / Bottom 0.035mm
Design rules "default *": minimum track width 10mil, minimum drill 12mil, track to track 8mil, track to pad 8mil, pad to pad 8mil, via to via 8mil, smd to smd 8mil, copper to edge 40mil, drill to drill 8mil, minimum pad ring 10mil, minimum via ring 8mil, stop-mask expansion 4mil, vias tented up to drill 0mil, thermal gap 10mil

### Footprints (pad centres in the part's own frame; a part is rotated, then mirrored left to right if it is on the bottom)
C025-024X044 = drill 0.813 octagon: 1 -1.27,0; 2 1.27,0
E2,5-7 = drill 0.813 pad 1.6: + -1.27,0 | drill 0.813 pad 1.6 octagon: - 1.27,0
E2,5-6 = drill 0.813 pad 1.6: + -1.27,0 | drill 0.813 pad 1.6 octagon: - 1.27,0
DO35-7 = drill 0.813 long: A 3.81,0; C -3.81,0
DIL14 = drill 0.813 long: 1 -7.62,-3.81; 2 -5.08,-3.81; 3 -2.54,-3.81; 4 0,-3.81; 5 2.54,-3.81; 6 5.08,-3.81; 7 7.62,-3.81; 8 7.62,3.81; 9 5.08,3.81; 10 2.54,3.81; 11 0,3.81; 12 -2.54,3.81; 13 -5.08,3.81; 14 -7.62,3.81
DIL20 = drill 0.813 long: 1 -10.16,-3.81; 2 -7.62,-3.81; 3 -5.08,-3.81; 4 -2.54,-3.81; 5 0,-3.81; 6 2.54,-3.81; 7 5.08,-3.81; 8 7.62,-3.81; 9 10.16,-3.81; 10 12.7,-3.81; 11 12.7,3.81; 12 10.16,3.81; 13 7.62,3.81; 14 5.08,3.81; 15 2.54,3.81; 16 0,3.81; 17 -2.54,3.81; 18 -5.08,3.81; 19 -7.62,3.81; 20 -10.16,3.81
DIL16 = drill 0.813 long: 1 -8.89,-3.81; 2 -6.35,-3.81; 3 -3.81,-3.81; 4 -1.27,-3.81; 5 1.27,-3.81; 6 3.81,-3.81; 7 6.35,-3.81; 8 8.89,-3.81; 9 8.89,3.81; 10 6.35,3.81; 11 3.81,3.81; 12 1.27,3.81; 13 -1.27,3.81; 14 -3.81,3.81; 15 -6.35,3.81; 16 -8.89,3.81
PLCC44 = drill 0.813 pad 1.397: 1 1.27,6.35 | drill 0.813 pad 1.397 octagon: 2 -1.27,8.89; 3 -1.27,6.35; 4 -3.81,8.89; 5 -3.81,6.35; 6 -6.35,8.89; 7 -8.89,6.35; 8 -6.35,6.35; 9 -8.89,3.81; 10 -6.35,3.81; 11 -8.89,1.27; 12 -6.35,1.27; 13 -8.89,-1.27; 14 -6.35,-1.27; 15 -8.89,-3.81; 16 -6.35,-3.81; 17 -8.89,-6.35; 18 -6.35,-8.89; 19 -6.35,-6.35; 20 -3.81,-8.89; 21 -3.81,-6.35; 22 -1.27,-8.89; 23 -1.27,-6.35; 24 1.27,-8.89; 25 1.27,-6.35; 26 3.81,-8.89; 27 3.81,-6.35; 28 6.35,-8.89; 29 8.89,-6.35; 30 6.35,-6.35; 31 8.89,-3.81; 32 6.35,-3.81; 33 8.89,-1.27; 34 6.35,-1.27; 35 8.89,1.27; 36 6.35,1.27; 37 8.89,3.81; 38 6.35,3.81; 39 8.89,6.35; 40 6.35,8.89; 41 6.35,6.35; 42 3.81,8.89; 43 3.81,6.35; 44 1.27,8.89
DIL40 = drill 0.813 long: 1 -16.51,-7.62; 2 -13.97,-7.62; 3 -11.43,-7.62; 4 -8.89,-7.62; 5 -6.35,-7.62; 6 -3.81,-7.62; 7 -1.27,-7.62; 8 1.27,-7.62; 9 3.81,-7.62; 10 6.35,-7.62; 11 8.89,-7.62; 12 11.43,-7.62; 13 13.97,-7.62; 14 16.51,-7.62; 15 19.05,-7.62; 16 21.59,-7.62; 17 24.13,-7.62; 18 26.67,-7.62; 19 29.21,-7.62; 20 31.75,-7.62; 21 31.75,7.62; 22 29.21,7.62; 23 26.67,7.62; 24 24.13,7.62; 25 21.59,7.62; 26 19.05,7.62; 27 16.51,7.62; 28 13.97,7.62; 29 11.43,7.62; 30 8.89,7.62; 31 6.35,7.62; 32 3.81,7.62; 33 1.27,7.62; 34 -1.27,7.62; 35 -3.81,7.62; 36 -6.35,7.62; 37 -8.89,7.62; 38 -11.43,7.62; 39 -13.97,7.62; 40 -16.51,7.62
DIL20' = drill 0.813 long: 1 -11.43,-3.81; 2 -8.89,-3.81; 3 -6.35,-3.81; 4 -3.81,-3.81; 5 -1.27,-3.81; 6 1.27,-3.81; 7 3.81,-3.81; 8 6.35,-3.81; 9 8.89,-3.81; 10 11.43,-3.81; 11 11.43,3.81; 12 8.89,3.81; 13 6.35,3.81; 14 3.81,3.81; 15 1.27,3.81; 16 -1.27,3.81; 17 -3.81,3.81; 18 -6.35,3.81; 19 -8.89,3.81; 20 -11.43,3.81
LED3MM = drill 0.813 octagon: A -1.27,0; K 1.27,0
CSABUS = drill 0.914 pad 1.6: A1 7.62,36.83 | drill 0.914 pad 1.6 octagon: A2 7.62,34.29; A3 7.62,31.75; A4 7.62,29.21; A5 7.62,26.67; A6 7.62,24.13; A7 7.62,21.59; A8 7.62,19.05; A9 7.62,16.51; A10 7.62,13.97; A11 7.62,11.43; A12 7.62,8.89; A13 7.62,6.35; A14 7.62,3.81; A15 7.62,1.27; A16 7.62,-1.27; A17 7.62,-3.81; A18 7.62,-6.35; A19 7.62,-8.89; A20 7.62,-11.43; A21 7.62,-13.97; A22 7.62,-16.51; A23 7.62,-19.05; A24 7.62,-21.59; A25 7.62,-24.13; A26 7.62,-26.67; A27 7.62,-29.21; A28 7.62,-31.75; A29 7.62,-34.29; A30 7.62,-36.83; A31 7.62,-39.37; A32 7.62,-41.91; C1 2.54,36.83; C2 2.54,34.29; C3 2.54,31.75; C4 2.54,29.21; C5 2.54,26.67; C6 2.54,24.13; C7 2.54,21.59; C8 2.54,19.05; C9 2.54,16.51; C10 2.54,13.97; C11 2.54,11.43; C12 2.54,8.89; C13 2.54,6.35; C14 2.54,3.81; C15 2.54,1.27; C16 2.54,-1.27; C17 2.54,-3.81; C18 2.54,-6.35; C19 2.54,-8.89; C20 2.54,-11.43; C21 2.54,-13.97; C22 2.54,-16.51; C23 2.54,-19.05; C24 2.54,-21.59; C25 2.54,-24.13; C26 2.54,-26.67; C27 2.54,-29.21; C28 2.54,-31.75; C29 2.54,-34.29; C30 2.54,-36.83; C31 2.54,-39.37; C32 2.54,-41.91 | hole 2.794: 10.16,41.91; 10.16,-46.99
SG51 = drill 0.813: 1 -7.62,-3.81; 7 7.62,-3.81; 8 7.62,3.81; 14 -7.62,3.81
0207/10 = drill 0.813 octagon: 1 -5.08,0; 2 5.08,0
RN-8 = drill 0.813 long: 1 -8.89,0; 2 -6.35,0; 3 -3.81,0; 4 -1.27,0; 5 1.27,0; 6 3.81,0; 7 6.35,0; 8 8.89,0
DIN6PIEC = drill 1.321 octagon: 1 7.62,5.08; 2 5.08,7.62; 3 0,5.08; 4 -5.08,7.62; 5 -7.62,5.08; 6 0,10.16 | drill 1.321: PE -2.54,-5.08; PE@ 2.54,-5.08; PE@1 -5.08,-5.08; PE@2 5.08,-5.08 | hole 2.794: 7.62,0; -7.62,0
JP5 = drill 0.914 long: 1 -6.35,2.54; 2 -3.81,2.54; 3 -1.27,2.54; 4 1.27,2.54; 5 3.81,2.54
M09HP = drill 1.016 octagon: 1 -5.486,1.27; 2 -2.743,1.27; 3 0,1.27; 4 2.743,1.27; 5 5.486,1.27; 6 -4.115,-1.27; 7 -1.372,-1.27; 8 1.372,-1.27; 9 4.115,-1.27 | drill 3.302 pad 5.08: G1 -12.522,0; G2 12.522,0

### Placement (x,y rotation side)
C1  21.58,62.55 180 top
C2  20.47,30.65 180 top
C3  11.58,5.72 180 top
C4  45.08,95.57 270 top
C5  81.59,61.28 270 top
C86  112.87,47.95 270 top
C87  112.71,41.76 270 top
C88  136.04,26.04 90 top
C89  136.2,35.09 90 top
C90  113.34,15.25 270 top
C91  113.18,21.6 270 top
C92  46.51,87.16 180 top
C93  71.11,87 270 top
C124  114.45,87.32 270 top
C131  114.3,73.35 270 top
C132  103.18,93.67 180 top
C133  71.27,71.92 270 top
C134  124.3,54.46 180 top
C135  123.98,27.95 180 top
C136  34.92,8.9 270 top
C137  34.92,23.18 270 top
C138  70,27.95 180 top
C139  88.26,51.12 180 top
D14  36.35,90.18 180 top
IC1  69.37,15.09 270 top
IC2  21.74,48.74 270 top
IC3  20.63,17.63 270 top
IC4  60.32,93.51 0 top
IC5  92.7,58.74 0 top
IC31  124.14,41.6 270 top
IC32  123.98,15.25 270 top
IC33  88.26,36.36 0 top
IC34  127.47,87.48 0 top
IC35  47.78,9.06 0 top
IC36  48.1,65.25 270 top
IC37  83.18,87.16 0 top
IC48  127.63,72.87 0 top
IC49  74HCT241N  [DIL20']  103.5,77.95 270 top
IC50  83.34,71.92 0 top
LED2  155.57,61.44 90 top
P4  13.01,47.47 180 top
QG3  48.1,23.34 0 top
R1  78.1,96.69 0 top
R102  150.81,55.89 180 top
R103  92.07,15.72 180 top
RN8  126.36,62.55 0 top
U$1  152.39,81.6 90 top
U$2  106.52,29.53 90 top
X3  147.79,36.84 90 top

### Tracks (layer width: path | path; a pad name or v marks a point on that pad's centre or on a via)
/BIOSEL  (via drill 0.6)
  Top 0.305: v30.16,28.42 30.16,56.2 28.73,57.63 23.01,57.63 21.74,58.9 IC2.1
  Bottom 0.305: P4.A7 6.98,25.88 8.25,27.15 13.33,27.15 14.6,28.42 v30.16,28.42
/BIRQ  (via drill 0.6)
  Top 0.305: P4.A24 6.98,69.06 8.25,70.33 11.74,70.33 13.17,71.76 13.17,72.4 17.14,76.36 v17.14,90.18 | D14.A 32.54,87.48 36.83,83.19 36.83,29.06 v36.67,28.9 | v61.43,28.9 v61.43,20.17
  Bottom 0.305: v17.14,90.18 D14.A | v36.67,28.9 v61.43,28.9 | v61.43,20.17 IC1.2
/BRES  (via drill 0.6)
  Top 0.305: v49.05,77.95 49.05,67 49.53,66.52 v49.68,66.52 | v58.89,17.63 58.89,66.36 58.73,66.52 IC36.34
  Bottom 0.305: P4.A27 6.66,76.68 7.93,77.95 v49.05,77.95 | v49.68,66.52 IC36.34 | IC1.3 v58.89,17.63
/IECSTART  (via drill 0.6)
  Top 0.305: v86.99,79.38 86.99,86.37 88.26,87.64 IC37.9
  Bottom 0.305: IC36.39 79.85,79.22 80.64,80.02 84.13,80.02 84.93,79.22 86.83,79.22 v86.99,79.38
/SEL1  (via drill 0.6)
  Top 0.305: v45.24,17.63 45.24,8.74 46.51,7.47 IC35.4
  Bottom 0.305: IC3.4 18.73,18.9 20,17.63 v45.24,17.63
/SEL5  (via drill 0.6)
  Top 0.305: v51.11,15.09 v51.11,38.42
  Bottom 0.305: IC3.5 21.58,16.36 22.86,15.09 30.63,15.09 31.11,14.61 35.55,14.61 36.03,15.09 41.91,15.09 42.22,14.77 43.33,14.77 43.65,15.09 v51.11,15.09 | v51.11,38.42 51.27,38.58 IC36.23
BA0  (via drill 0.6)
  Top 0.305: P4.C23 12.06,66.52 12.54,67 12.54,69.7 v16.5,73.67 | v62.07,76.68 62.23,76.68 63.65,75.25 63.65,36.52 65.56,34.61 65.56,33.98 65.4,33.82 v64.61,33.82
  Bottom 0.305: v16.5,73.67 18.25,75.41 49.05,75.41 49.68,76.05 50.95,76.05 51.59,76.68 IC36.38 v62.07,76.68 | IC33.31 96.83,32.55 95.56,31.28 74.29,31.28 71.75,33.82 v64.61,33.82
BA1  (via drill 0.6)
  Top 0.305: P4.C22 12.7,63.98 13.65,64.94 13.65,68.75 v16.82,71.92 | v61.43,74.14 62.7,72.87 62.7,30.8 63.81,29.69 v63.81,24.29 | v76.19,28.9 v76.19,24.29
  Bottom 0.305: v16.82,71.92 16.98,71.92 17.93,72.87 48.73,72.87 50,74.14 IC36.37 v61.43,74.14 | IC33.30 93.34,28.74 76.35,28.74 v76.19,28.9 | v76.19,24.29 v63.81,24.29
BA2  (via drill 0.6)
  Top 0.305: P4.C21 13.33,61.44 14.44,62.55 14.44,67.16 v17.14,69.86 | v61.27,71.44 61.27,30.8 62.54,29.53 v62.54,18.9 | IC33.29 97.15,20.96 v96.99,20.8
  Bottom 0.305: v17.14,69.86 17.14,70.01 17.3,70.17 17.46,70.17 17.62,70.33 48.26,70.33 49.53,71.6 IC36.36 61.11,71.6 v61.27,71.44 | v62.54,18.9 75.56,18.9 76.19,19.53 86.67,19.53 87.94,20.8 v96.99,20.8
BA3  (via drill 0.6)
  Top 0.305: P4.C20 13.49,58.9 15.39,60.81 15.39,66.05 16.98,67.63 17.14,67.63 v17.3,67.79 | IC35.3 43.97,7.47 43.02,8.42 42.86,8.42 42.86,8.58 42.7,8.74 v42.7,15.88 | v32.38,15.72 v32.38,67
  Bottom 0.305: v17.3,67.79 32.54,67.79 | 32.54,67.79 48.26,67.79 49.53,69.06 IC36.35 | v42.7,15.88 32.54,15.88 v32.38,15.72 | v32.38,67 32.38,67.63 32.54,67.79
BA4
  Top 0.305: P4.C19 12.54,56.36 15.08,53.82 IC2.3
BA5
  Top 0.305: P4.C18 13.01,53.82 14.28,52.55 21.11,52.55 22.38,53.82 IC2.18
BA6
  Top 0.305: P4.C17 9.52,51.28 8.09,49.85 8.09,27.95 8.89,27.15 12.06,27.15 15.24,23.98 IC3.2
BA7
  Top 0.305: P4.C16 13.01,48.74 14.28,47.47 21.27,47.47 22.54,48.74 IC2.16
BA8
  Top 0.305: P4.C15 12.54,46.2 15.08,43.66 IC2.7
BA9
  Top 0.305: P4.C14 13.01,43.66 14.28,42.39 20.95,42.39 22.22,43.66 IC2.14
BA10
  Bottom 0.305: P4.C13 12.85,41.12 15.39,38.58 IC2.9
BA11
  Bottom 0.305: P4.C12 13.17,38.58 14.6,37.15 20.95,37.15 22.38,38.58 IC2.12
BD0  (via drill 0.6)
  Top 0.305: v72.86,63.82 72.86,62.08 73.34,61.6 73.34,58.43 74.45,57.32 74.45,56.36 v74.29,56.36 80.96,49.69 85.4,49.69 85.88,49.22 85.88,47.31 86.99,46.2 IC33.2
  Bottom 0.305: P4.A22 6.82,63.98 8.09,62.71 15.71,62.71 17.3,61.12 24.76,61.12 26.35,62.71 48.57,62.71 49.84,63.98 IC36.33 72.7,63.98 v72.86,63.82
BD1  (via drill 0.6)
  Top 0.305: v75.72,61.44 76.04,58.11 77.78,57.63 77.78,53.82 80.96,50.65 85.4,50.65 86.99,49.06 86.99,48.11 88.26,46.84 88.26,43.98 IC33.3
  Bottom 0.305: P4.A21 6.98,61.44 8.25,60.17 48.57,60.17 49.84,61.44 IC36.32 67.94,61.44 68.26,61.76 73.02,61.76 73.34,61.44 v75.72,61.44
BD2  (via drill 0.6)
  Top 0.305: v70.64,60.01 70.64,59.22 72.23,57 72.23,55.09 72.7,54.62 72.7,51.92 73.66,50.97 v73.81,48.74 | IC33.4 v84.45,48.74
  Bottom 0.305: P4.A20 6.98,58.9 8.25,57.63 48.73,57.63 50,58.9 IC36.31 63.18,58.9 63.65,59.38 69.84,59.38 v70.64,60.01 | v84.45,48.74 v73.81,48.74
BD3  (via drill 0.6)
  Top 0.305: v71.11,56.36 71.11,55.09 71.75,54.46 71.75,51.92 72.54,51.12 72.54,47.95 74.45,46.04 v74.45,43.82
  Bottom 0.305: P4.A19 6.82,56.36 8.09,55.09 49.05,55.09 50.32,56.36 IC36.30 62.86,56.36 63.18,56.68 67.94,56.68 68.26,56.36 v71.11,56.36 | IC33.5 83.81,42.71 82.7,43.82 v74.45,43.82
BD4  (via drill 0.6)
  Top 0.305: v70.64,53.82 70.64,51.92 71.11,51.44 71.11,50.81 71.75,50.17 71.75,47.63 72.54,46.84 v72.54,46.2
  Bottom 0.305: P4.A18 6.66,53.82 7.93,52.71 8.25,52.55 48.57,52.55 50,53.82 IC36.29 v70.64,53.82 | IC33.6 73.5,45.25 v72.54,46.2
BD5  (via drill 0.6)
  Top 0.305: v70,51.12 70,50.65 70.8,49.85 70.8,47.31 71.43,46.68 71.43,43.82 v71.75,43.66
  Bottom 0.305: P4.A17 6.66,51.28 7.93,50.01 49.84,50.01 51.11,51.28 IC36.28 69.84,51.28 v70,51.12 | IC33.7 72.7,42.71 v71.75,43.66
BD6  (via drill 0.6)
  Top 0.305: v69.84,48.74 69.84,47.15 70.48,46.52 70.48,41.12 v70.8,41.12
  Bottom 0.305: P4.A16 6.66,48.74 7.93,47.47 49.53,47.47 50.8,48.74 IC36.27 v69.84,48.74 | IC33.8 81.75,42.71 80.32,41.28 70.96,41.28 v70.8,41.12
BD7  (via drill 0.6)
  Top 0.305: v69.37,46.2 69.37,41.6 69.84,41.12 v69.84,40.17
  Bottom 0.305: P4.A15 6.82,46.2 8.09,44.93 49.21,44.93 50.48,46.2 IC36.26 v69.37,46.2 | IC33.9 v69.84,40.17
BPHI2  (via drill 0.6)
  Top 0.305: P4.C26 13.33,74.14 15.39,76.21 v15.39,80.33 | IC4.11 60.32,95.1 59.05,93.83 59.05,87.16 60.32,85.89 v60.32,83.03 v60.32,43.66 v60.32,34.93 60.32,11.6 v62.38,9.53
  Bottom 0.305: v15.39,80.33 39.05,80.33 39.21,80.49 46.98,80.49 49.53,83.03 v60.32,83.03 | v60.32,43.66 IC36.25 | IC35.6 51.59,6.04 53.02,7.47 61.75,7.47 62.07,7.79 63.06,8.53 | 63.06,8.53 63.34,8.74 76.51,8.58 77.15,9.21 83.66,9.21 83.97,9.53 v84.93,9.53 | IC33.15 75.08,32.55 72.7,34.93 60.48,34.93 | 60.48,34.93 60.32,35.09 | 60.48,34.93 v60.32,34.93 | v62.38,9.53 62.38,9.2 63.06,8.53
BR/-W  (via drill 0.6)
  Top 0.305: IC35.1 38.89,7.94 40.16,9.21 40.16,16.2 42.7,18.74 42.7,34.45 v44.29,36.04 | v34.92,76.68 v34.92,34.77
  Bottom 0.305: IC36.22 v44.29,36.04 43.02,34.77 v34.92,34.77 | P4.C25 12.85,71.6 17.93,76.68 v34.92,76.68
CLKIN  (via drill 0.6)
  Top 0.305: v128.58,57.47 128.9,57.79 128.9,73.35 130.17,74.62 IC48.10 | v64.92,44.93 v64.92,55.09
  Bottom 0.305: IC36.16 49.53,43.66 50.8,44.93 v64.92,44.93 | v128.58,57.47 126.84,57.47 126.36,57.95 121.44,57.95 121.12,57.63 113.34,57.63 112.71,57 105.72,57 101.59,52.87 80.64,52.87 78.73,54.77 66.03,54.77 65.72,55.09 v64.92,55.09
CLKOUT  (via drill 0.6)
  Top 0.305: v108.74,54.3 108.74,62.71 110.48,64.46 110.48,93.35 111.91,94.78 v122.39,94.78
  Bottom 0.305: IC36.14 49.84,48.74 51.11,50.01 104.45,50.01 v108.74,54.3 | v122.39,94.78 IC34.13
CTS  (via drill 0.6)
  Top 0.305: X3.8 144.2,38.21 143.5,38.9 v143.5,42.87
  Bottom 0.305: v143.5,42.87 IC31.13
DATA  (via drill 0.6)
  Top 0.305: IC34.2 122.39,76.84 IC48.13 | v104.45,77.95 104.45,67.79 105.72,66.52 IC49.11 | v127.79,87.16 127.79,87.48 130.01,89.7 IC34.10 | v147.31,65.41 U$1.5 | v134.62,86.84 132.71,84.94 132.71,83.83 IC34.6
  Bottom 0.305: IC48.13 122.55,77.95 120.96,79.54 111.44,79.54 110.01,78.11 109.85,78.11 109.69,77.95 v104.45,77.95 | IC49.11 110.48,66.52 116.68,60.33 125.41,60.33 RN8.5 127.63,63.82 128.27,64.46 130.81,64.46 131.12,64.14 131.92,64.14 132.23,64.46 133.66,64.46 134.46,65.25 147.16,65.25 v147.31,65.41 | IC34.2 122.39,85.41 124.45,87.48 127.47,87.48 v127.79,87.16 134.3,87.16 v134.62,86.84
DATAIN  (via drill 0.6)
  Top 0.305: v123.82,57 123.82,56.84 121.28,59.38 121.28,71.92 123.82,74.46 123.82,74.94 IC48.12 | v67.78,42.39 67.78,42.87 68.26,43.34 68.26,47.31 v68.57,47.63
  Bottom 0.305: IC36.17 48.41,41.12 49.68,42.39 v67.78,42.39 | v123.82,57 113.66,57 106.52,49.22 86.83,49.22 85.24,47.63 v68.57,47.63
DATAOUT  (via drill 0.6)
  Top 0.305: v127.47,94.3 127.31,94.14 123.66,94.14 123.34,93.83 120.96,93.83 120.8,93.99 112.39,93.99 111.12,92.72 111.12,59.38 v110.96,59.06 | v66.19,47.47 v66.19,57.63
  Bottom 0.305: IC36.15 49.53,46.2 50.8,47.47 v66.19,47.47 | v127.47,94.3 IC34.11 | v66.19,57.63 72.38,57.63 72.54,57.47 86.51,57.47 87.47,58.27 104.77,58.27 105.56,59.06 v110.96,59.06
DCD  (via drill 0.6)
  Top 0.305: IC32.8 124.45,6.36 125.57,7.47 125.72,7.47 v125.88,7.63 | v141.6,7.63 v141.6,40.8
  Bottom 0.305: v125.88,7.63 v141.6,7.63 | v141.6,40.8 148.91,40.8 X3.9
DFASTIECCLK  (via drill 0.6)
  Top 0.305: IC49.2 98.58,86.84 97.15,85.41 97.15,75.09 98.1,74.14 IC49.7
  Top 0.406: IC36.18 41.59,38.58 42.86,39.85 42.86,84.3 v43.02,84.46
  Bottom 0.305: 64.13,84.46 68.42,84.46 68.89,83.98 72.23,83.98 74.77,86.53 89.69,86.53 90.16,87 91.75,87 92.23,86.53 99.37,86.53 IC49.2
  Bottom 0.406: v43.02,84.46 64.13,84.46
DSR  (via drill 0.6)
  Top 0.305: v142.71,16.52 142.71,30.33 145.09,32.71 149.05,32.71 X3.6
  Bottom 0.305: IC32.13 v142.71,16.52
DTR  (via drill 0.6)
  Top 0.305: v140.65,19.22 v140.65,39.69
  Bottom 0.305: IC32.14 140.49,19.06 v140.65,19.22 | v140.65,39.69 146.41,39.69 X3.4
FASTCLK  (via drill 0.6)
  Top 0.305: IC34.4 127.47,80.97 128.74,79.7 128.9,79.38 128.9,75.25 126.36,72.71 v126.36,59.86
  Bottom 0.305: IC49.17 125.57,81.76 IC34.4 127.47,85.25 127.95,85.73 137.63,85.73 141.28,89.38 147.16,89.38 U$1.1 | v126.36,59.86 129.38,59.86 130.17,60.65 RN8.6
FASTIECCLK  (via drill 0.6)
  Top 0.305: IC4.12 v57.78,93.51 | IC37.8 90.8,85.89 v90.96,85.73
  Bottom 0.305: IC50.8 90.96,78.59 89.53,80.02 89.53,85.73 90.8,85.73 v90.96,85.73 95.24,85.73 96.67,84.3 IC49.3 | v57.78,93.51 88.26,93.51 IC37.8
FASTIECDATA  (via drill 0.6)
  Top 0.305: v65.24,39.22 65.24,41.92 67.62,44.3 67.62,68.9 v67.46,69.06
  Bottom 0.305: IC36.19 42.06,36.04 43.49,37.47 44.92,37.47 45.08,37.31 63.34,37.31 v65.24,39.22 | IC49.8 IC49.9 95.72,69.06 94.93,69.86 76.99,69.86 75.72,68.59 IC50.1 72.86,68.11 72.38,68.59 68.42,68.59 67.94,69.06 v67.46,69.06
FCLKINT
  Top 0.305: RN8.7 132.71,65.09 133.98,66.36 133.98,73.03 132.71,74.3 IC48.9
  Bottom 0.305: IC49.18 105.72,84.3 104.77,83.35 104.77,81.29 105.56,80.49 122.39,80.49 123.82,79.06 125.57,79.06 126.36,78.27 126.36,75.09 126.99,74.46 132.07,74.46 132.71,75.09 IC48.9
FDATAINT  (via drill 0.6)
  Top 0.305: v135.25,66.68 RN8.8
  Bottom 0.305: IC49.12 112.39,69.06 114.77,67.32 129.85,67.32 130.01,67.48 130.01,68.9 IC48.5 130.17,67.79 131.12,66.84 134.3,66.84 v135.25,66.68
FSERDIR  (via drill 0.6)
  Top 0.305: IC49.19 104.77,86.84 102.23,89.38 IC49.1 95.56,89.38 94.61,88.43 94.61,72.24 96.52,70.33 v96.52,59.54
  Bottom 0.305: IC36.10 48.73,58.9 49.84,60.01 68.1,60.01 69.21,61.12 72.38,61.12 72.7,60.81 74.13,59.22 78.89,59.22 79.21,58.9 83.66,58.9 83.97,59.54 v96.52,59.54
FUP0  (via drill 0.6)
  Top 0.305: v79.53,80.49 79.53,71.44 80.8,70.01 IC50.3
  Bottom 0.305: IC36.2 47.78,79.22 49.05,80.49 v79.53,80.49
FUP1  (via drill 0.6)
  Top 0.305: v82.23,79.06 82.23,71.6 83.34,70.49 IC50.4
  Bottom 0.305: IC36.3 49.84,76.68 51.11,77.95 63.5,77.95 63.97,78.43 80,78.43 80.64,79.06 v82.23,79.06
FUP2  (via drill 0.6)
  Top 0.305: v84.61,77.64 84.61,71.92 85.88,70.65 IC50.5
  Bottom 0.305: IC36.4 48.73,74.14 50,75.41 71.59,75.41 73.5,77.64 v84.61,77.64
FUP3  (via drill 0.6)
  Top 0.305: v88.42,73.03 IC50.6
  Bottom 0.305: IC36.5 48.41,71.6 49.21,72.4 49.53,72.4 50,72.87 66.83,72.87 68.26,74.3 73.5,74.3 74.92,72.87 88.26,72.87 v88.42,73.03
FUP4  (via drill 0.6)
  Top 0.305: v87.31,71.13 87.31,71.44 85.88,72.87 IC50.10
  Bottom 0.305: IC36.6 48.1,69.06 49.37,70.33 68.1,70.33 69.05,69.38 73.5,69.38 75.08,71.13 v87.31,71.13
FUP5  (via drill 0.6)
  Top 0.305: v84.77,66.2 84.77,70.49 83.34,71.92 IC50.11
  Bottom 0.305: IC36.7 48.1,66.52 49.37,67.79 70.8,67.79 72.38,66.2 v84.77,66.2
FUP6  (via drill 0.6)
  Top 0.305: IC50.12 80.8,71.6 82.07,70.33 v82.07,65.09
  Bottom 0.305: v82.07,65.09 81.75,65.09 81.59,65.25 48.73,65.25 47.46,63.98 IC36.8
FUP7  (via drill 0.6)
  Top 0.305: IC50.13 78.26,71.28 79.53,69.86 v79.53,62.71
  Bottom 0.305: IC36.9 48.57,61.44 49.84,62.71 v79.53,62.71
GND  (via drill 0.6)
  Top 0.305: IC2.4 IC2.5 | IC2.4 IC2.17 26.66,51.28 27.62,50.33 27.62,47 26.82,46.2 | 26.82,46.2 IC2.15 | IC2.13 26.51,41.12 27.62,42.23 27.62,45.41 26.82,46.2 | IC2.4 13.49,51.28 12.22,52.55 8.25,52.55 7.14,53.66 7.14,64.14 8.25,65.25 v12.38,65.25 | 135.09,69.22 IC48.7 | C138.2 68.73,28.1 | 114.45,71.92 C131.2 | v114.45,53.82 113.98,53.82
  Top 0.61: IC4.7 67.94,87.64 69.84,85.73 C93.2 | C133.2 71.27,68.9 74.61,65.57 v74.61,63.98
  Top 0.813: P4.C1 12.85,10.64 13.49,11.28 13.49,20.33 14.6,21.44 IC3.3 18.57,21.44 19.2,22.07 C2.2 | C124.2 114.45,79.06 112.71,77.32 112.71,73.67 C131.2 | 135.09,72.24 135.09,72.87 137,74.78 137,81.76 IC34.7 | 135.09,72.24 135.09,69.22 | IC37.7 90.8,81.45 92.39,79.86 92.39,72.4 90.96,70.97 IC50.7 | IC32.15 126.04,21.6 124.61,23.03 124.61,24.29 122.71,26.2 C135.2 | 68.73,28.1 66.99,29.85 v66.99,38.58 | C137.2 34.92,13.18 33.33,11.6 33.33,9.21 C136.2 | C93.2 71.11,77.16 69.69,75.73 69.69,72.24 C133.2 | v32.86,82.87 30.63,80.65 v30.63,65.25 | v57.46,30.49 v57.46,24.14 | C92.2 45.24,38.26 47.46,36.04 v47.46,31.28 v47.46,26.52 | v108.42,44.77 108.42,27.31 v108.58,27.15 | v136.84,72.56 135.41,72.56 135.09,72.24 | v114.45,53.82 114.45,63.82 114.93,64.3 114.93,67.48 114.45,67.95 114.45,71.92 | IC33.16 IC33.21 IC33.22 IC33.25 | 86.35,52.55 86.35,60.01 | 86.35,60.01 86.35,64.3 v86.99,64.94 | IC49.10 99.69,65.57 99.05,64.94 99.05,59.22 100.32,57.95 IC5.7 100.32,52.23 103.5,49.06 104.13,49.06 v108.42,44.77 | 113.98,53.82 110.48,50.33 110.48,46.84 v108.42,44.77 | C5.2 86.35,60.01
  Top 1.016: C139.2 86.99,51.92 86.35,52.55
  Bottom 0.305: v12.38,65.25 15.24,65.25 17.93,62.55 C1.2 | P4.C1 14.92,10.64 IC3.8 | IC34.7 137.95,83.67 140.97,86.68 U$1.2 146.68,86.21 156.2,86.21 | 156.2,86.21 157,86.21 U$1.PE@2 | 156.2,86.21 157.47,84.94 U$1.PE@ U$1.PE U$1.PE@1
  Bottom 0.61: v74.61,63.98 83.18,63.98 83.81,64.94 v86.99,64.94 | C93.2 44.13,85.73 43.49,86.37 | v57.46,30.49 58.73,30.49 59.37,31.12 63.18,31.12 65.08,29.22 67.46,29.22 C138.2
  Bottom 0.813: P4.C1 P4.A1 C3.- | v86.99,64.94 90.32,64.94 90.96,65.57 IC50.7 92.55,66.52 IC49.10 | C131.2 115.09,72.08 116.04,73.03 122.55,73.03 123.03,72.56 v136.84,72.56 | C137.2 38.1,21.91 40.48,24.29 45.24,24.29 v47.46,26.52 | v47.46,31.28 49.53,31.28 50.32,30.49 v57.46,30.49 | QG3.7 55.72,22.39 v57.46,24.14 | v114.45,53.82 120.8,53.82 121.44,54.46 C134.2 123.03,50.97 126.04,47.95 IC31.15
  pour Bottom (isolate 0.813): 1.27,98.91 158.75,99.23 158.75,1.44 1.27,1.12
IECEND  (via drill 0.6)
  Top 0.305: v76.99,81.45 76.99,81.76 76.83,81.92 76.83,86.53 78.1,87.79 IC37.13
  Bottom 0.305: IC36.40 72.23,81.76 72.7,81.29 76.51,81.29 v76.99,81.45
LCTS  (via drill 0.6)
  Top 0.305: IC33.40 99.53,45.25 v102.07,42.71 | v110.48,27.31 v110.48,41.12
  Bottom 0.305: v102.07,42.71 108.42,42.71 109.53,41.76 110.17,41.76 | 110.17,41.76 114.77,41.76 114.93,41.6 123.66,41.6 124.93,40.33 IC31.12 | U$2.2 108.9,25.72 v110.48,27.31 | v110.48,41.12 110.48,41.44 110.17,41.76
LDCD  (via drill 0.6)
  Top 0.305: v106.2,7.79 106.2,45.09 100.17,51.28 94.77,51.28 92.07,48.58 IC33.42
  Bottom 0.305: IC32.9 124.77,6.36 123.5,7.63 105.72,7.63 v106.2,7.79
LDSR  (via drill 0.6)
  Top 0.305: v101.44,12.71 101.44,41.6 98.42,44.3 96.2,44.3 IC33.41
  Bottom 0.305: IC32.12 124.93,13.98 123.66,12.71 v101.44,12.71
LDTR  (via drill 0.6)
  Top 0.305: v100.32,10.17 v100.32,40.17
  Bottom 0.305: IC32.11 125.57,11.44 124.3,10.17 v100.32,10.17 | IC33.37 v100.32,40.17 100.48,40.17
LRTS  (via drill 0.6)
  Top 0.305: U$2.5 v103.98,38.11
  Bottom 0.305: IC31.11 125.41,37.79 124.14,36.52 115.25,36.52 112.71,38.9 103.66,38.9 | IC33.36 94.93,37.63 96.2,38.9 103.66,38.9 | v103.98,38.11 103.98,38.58 103.66,38.9
LRX  (via drill 0.6)
  Top 0.305: v107.15,41.44 v107.15,32.39
  Bottom 0.305: IC31.9 125.88,30.65 114.61,30.65 112.87,32.39 v107.15,32.39 106.83,32.39 105.25,30.8 U$2.4 | IC33.11 79.53,37.63 80.8,38.9 90.8,38.9 93.34,41.44 v107.15,41.44
LTX  (via drill 0.6)
  Top 0.305: v111.6,29.06 v111.6,35.72
  Bottom 0.305: IC31.10 125.57,35.25 124.3,33.98 114.61,33.98 112.23,36.36 111.6,36.36 | IC33.13 79.53,35.09 80.8,36.36 111.6,36.36 | U$2.3 107.47,28.26 108.42,29.22 111.44,29.22 v111.6,29.06 | v111.6,35.72 111.6,36.36
N$1  (via drill 0.6)
  Top 0.305: v119.85,88.27 IC34.1 | v138.58,71.76 138.58,85.25 v135.57,88.27
  Bottom 0.305: IC48.6 132.71,70.81 133.66,71.6 138.42,71.6 v138.58,71.76 | v135.57,88.27 v119.85,88.27
N$2  (via drill 0.6)
  Top 0.305: IC34.3 v124.93,80.49 | v135.25,80.65 IC48.8
  Bottom 0.305: v124.93,80.49 135.09,80.49 v135.25,80.65
N$3  (via drill 0.6)
  Top 0.305: IC2.19 27.46,56.36 28.73,55.09 v28.73,33.5 | v16.82,33.5 IC3.1
  Bottom 0.305: v28.73,33.5 v16.82,33.5
N$4  (via drill 0.6)
  Top 0.305: v65.08,71.76 65.08,87 64.13,87.95 64.13,94.14 65.4,95.42 IC4.9
  Bottom 0.305: IC49.13 103.5,71.6 102.23,72.87 91.59,72.87 90.48,71.76 88.26,71.76 87.78,72.24 72.86,72.24 72.38,71.76 v65.08,71.76
N$5  (via drill 0.6)
  Top 0.305: v104.13,56.68 104.13,65.25 103.5,65.89 v103.5,85.25 | v131.12,89.38 131.12,86.84 130.17,85.89 130.17,83.83 IC34.5
  Bottom 0.305: IC5.3 90.16,56.68 90.48,57 103.82,57 v104.13,56.68 | v103.5,85.25 103.82,85.25 104.13,85.57 112.07,85.57 113.34,84.3 115.88,84.3 117.15,85.57 117.15,87.79 118.74,89.38 v131.12,89.38
N$11
  Bottom 0.305: QG3.8 62.86,27.15 65.08,24.93 74.92,24.93 75.24,25.25 79.69,25.25 IC33.18
N$112
  Bottom 0.305: IC31.3 114.14,45.41 C86.-
N$118
  Bottom 0.305: IC31.1 114.14,50.49 C86.+
N$122  (via drill 0.6)
  Top 0.305: v51.11,90.34 51.11,43.82 53.02,41.92 53.02,33.98 53.49,33.5 IC36.21
  Bottom 0.305: D14.C 50.95,90.18 v51.11,90.34
N$149
  Bottom 0.305: IC32.3 114.45,19.06 C91.-
N$150
  Bottom 0.305: IC32.1 114.45,24.14 C91.+
N$151
  Bottom 0.305: IC31.5 112.87,40.33 C87.-
N$152
  Bottom 0.305: IC31.4 112.87,42.87 C87.+
N$153
  Bottom 0.305: IC32.5 C90.-
N$154
  Bottom 0.305: IC32.4 C90.+
N$155  (via drill 0.6)
  Top 0.305: v131.6,39.06 131.6,31.76 C88.- 138.42,24.93 v138.42,12.55
  Bottom 0.305: IC31.6 123.34,37.79 124.61,39.06 v131.6,39.06 | IC32.6 123.98,11.44 125.09,12.55 v138.42,12.55
N$156  (via drill 0.6)
  Top 0.305: v136.2,30.8 C89.+ 134.14,35.88 134.14,40.49 130.49,44.14 125.57,44.14 121.76,47.95 IC31.2
  Bottom 0.305: IC32.2 123.19,21.6 124.3,22.71 124.45,22.71 124.45,22.87 131.6,22.87 132.55,23.82 132.55,27.15 v136.2,30.8
N$157
  Top 0.305: IC33.10 81.43,40.17 80.16,38.9 77.62,38.9 76.67,37.95 76.67,32.71 IC33.17
N$158  (via drill 0.6)
  Top 0.305: IC33.33 97.78,35.09 98.42,34.3 v98.42,21.91
  Bottom 0.305: IC1.1 68.57,22.71 69.84,21.44 76.67,21.44 77.15,21.91 v98.42,21.91
N$159  (via drill 0.6)
  Top 0.305: IC33.20 84.45,14.61 v84.29,14.45
  Bottom 0.305: IC35.11 51.59,13.34 53.18,14.93 59.21,14.93 60.32,13.82 76.83,13.82 77.46,13.18 78.73,14.45 v84.29,14.45
N$160  (via drill 0.6)
  Top 0.305: IC33.24 v89.53,13.5
  Bottom 0.305: IC35.10 54.13,11.12 55.08,10.96 61.27,10.96 62.38,11.28 76.83,11.28 77.78,11.75 82.39,11.75 83.18,12.55 88.89,12.55 89.53,13.18 v89.53,13.5
N$162
  Top 0.305: LED2.A 155.57,56.2 R102.1
N$163
  Top 0.305: IC1.5 69.53,12.55 70.96,11.12 76.99,11.12 77.15,11.28 77.46,11.6 89.37,11.6 90.8,13.02 90.8,31.28 91.12,31.6 91.12,36.84 94.45,40.17 IC33.38
N$164  (via drill 0.6)
  Top 0.305: IC1.6 69.21,10.01 70.96,8.74 76.51,8.74 77.46,9.21 82.55,9.21 83.66,7.79 85.08,7.79 v85.56,6.83 | v139.69,4.61 139.69,50.49 143.03,53.82 148.74,53.82 152.39,57.47 152.39,59.54 LED2.K
  Bottom 0.305: v85.56,6.83 92.39,6.83 93.66,6.04 113.82,6.04 115.25,4.61 v139.69,4.61
OPENHIGH  (via drill 0.6)
  Top 0.305: v92.7,93.67 v92.7,82.56 93.66,81.6 93.66,70.81 95.24,69.22 IC5.10 IC5.5 | IC4.4 60.32,92.24 62.86,94.78 IC4.10 | IC1.11 71.75,15.09 70.48,13.82 63.18,13.82 63.1,13.9 | 63.1,13.9 62.7,14.29 v62.7,16.36 62.7,17.15 64.45,18.9 71.91,18.9 IC1.13 73.66,20.17 75.24,21.76 75.24,41.92 76.04,42.71 76.04,52.87 73.18,55.73 73.18,57.32 72.23,58.27 72.23,61.92 70.8,63.35 70.8,67.95 67.46,71.28 67.46,86.37 66.67,87.16 v66.67,94.94 | IC1.9 70.64,10.01 69.37,11.28 63.02,11.28 62.86,11.44 62.86,13.66 63.1,13.9 | IC4.1 52.7,88.59 53.97,86.68 55.24,86.68 | 55.24,86.68 56.83,86.68 57.78,88.43 IC4.3 | IC4.2 55.24,86.68
  Bottom 0.305: IC48.1 120.01,70.81 119.22,71.6 116.36,71.6 115.41,70.65 113.5,70.65 111.28,72.87 106.36,72.87 104.77,73.83 104.77,76.52 104.93,76.68 | IC49.6 102.07,76.68 | 102.07,76.68 104.93,76.68 | 104.93,76.68 IC49.15 | 102.07,76.68 102.07,80.81 101.12,81.76 IC49.4 98.9,82.56 v92.7,82.56 | IC4.13 55.24,95.89 56.19,94.94 61.91,94.94 63.02,96.05 63.02,97.16 IC4.10 62.86,96.21 63.97,95.1 66.83,95.1 | 66.83,95.1 73.02,95.1 | 73.02,95.1 91.28,95.1 v92.7,93.67 | IC4.3 IC4.4 | R1.1 73.02,95.1 | IC5.13 IC5.12 90.16,63.35 91.75,64.94 93.97,64.94 95.24,63.66 IC5.10 IC5.9 | IC5.4 IC5.5 | IC3.15 27.3,23.98 31.74,19.53 37.14,19.53 38.25,18.42 43.02,18.42 43.65,19.06 52.86,19.06 55.88,16.04 59.05,16.04 59.21,16.2 61.27,16.2 61.43,16.36 v62.7,16.36 | v66.67,94.94 66.83,95.1
RTS  (via drill 0.6)
  Top 0.305: v138.58,35.41 138.58,45.09 v138.27,45.41
  Bottom 0.305: X3.7 138.64,35.46 v138.58,35.41 | v138.27,45.41 IC31.14
RX
  Bottom 0.305: IC31.8 124.77,32.71 126.04,33.98 131.6,33.98 133.34,32.23 144.66,32.23 X3.2
SATN  (via drill 0.6)
  Top 0.305: v131.44,65.57 131.44,85.89 135.25,89.7 | 135.25,89.7 135.25,91.13 IC34.8 | 135.25,89.7 140.81,89.7 142.71,91.61 148.59,91.61 149.38,90.34 149.38,84.14 U$1.3 | IC48.3 v125.09,65.57
  Bottom 0.305: RN8.3 122.55,63.98 123.34,65.41 125.41,65.41 | 125.41,65.41 126.52,65.41 126.68,65.25 128.58,65.25 129.53,65.57 v131.44,65.57 | v125.09,65.57 125.41,65.41
SATNAOUT  (via drill 0.6)
  Top 0.305: v85.08,58.58 IC5.1
  Bottom 0.305: IC36.11 48.89,56.36 50.16,57.63 63.81,57.63 64.92,58.74 72.54,58.74 73.02,58.27 84.13,58.27 84.45,58.58 v85.08,58.58
SATNIN  (via drill 0.6)
  Top 0.305: v112.39,58.27 113.34,59.22 v113.34,66.52 | v127.63,66.2 IC48.4
  Bottom 0.305: IC36.12 48.89,53.82 50.16,55.09 62.54,55.09 63.5,56.04 66.35,56.04 67.3,55.41 76.19,55.41 77.78,56.68 87.62,56.68 | 87.62,56.68 IC5.2 | 87.62,56.68 87.62,57 88.26,57.63 111.44,57.63 112.07,58.27 v112.39,58.27 | v113.34,66.52 125.72,66.52 126.04,66.2 v127.63,66.2
SATNOUT  (via drill 0.6)
  Top 0.305: v112.23,60.17 112.23,60.65 111.91,60.97 111.91,91.76 113.34,93.19 132.55,93.19 IC34.9 | v102.23,52.23 v102.23,60.17
  Bottom 0.305: IC36.13 49.21,51.28 50.32,52.39 50.48,52.39 50.64,52.55 79.37,52.55 79.69,52.23 v102.23,52.23 | v102.23,60.17 v112.23,60.17
SIFC  (via drill 0.6)
  Top 0.305: RN8.4 125.09,63.82 123.82,65.09 123.82,72.24 v124.93,73.83 | v141.44,73.83 141.44,80.81 U$1.6
  Bottom 0.305: v124.93,73.83 v141.44,73.83
SLOWCLK
  Top 0.305: IC48.11 127.63,79.22 126.2,80.65 126.2,87.32 124.93,88.59 124.93,89.06 | 124.93,89.06 IC34.12 | RN8.2 120.01,64.62 118.42,66.2 118.42,70.97 121.28,73.51 121.28,85.41 124.93,89.06
  Bottom 0.305: IC48.11 127.63,78.75 128.27,79.38 141.92,79.38 U$1.4
TX
  Bottom 0.305: IC31.7 124.14,35.25 125.41,36.52 131.6,36.52 133.34,38.26 145.09,38.26 X3.3
UARTRES  (via drill 0.6)
  Top 0.305: IC1.4 69.37,15.09 70.64,16.36 75.24,16.36 v76.04,17.15 | IC33.39 98.26,42.71 99.21,41.76 99.21,23.18 99.53,22.23 99.53,18.74 R103.1
  Bottom 0.305: v76.04,17.15 95.72,17.15 R103.1
VCC  (via drill 0.6)
  Top 0.305: C2.1 21.9,30.65 | 75.72,83.19 IC37.1 | C132.1 104.29,93.67 | C124.1 115.09,88.59 | C134.1 125.57,54.77 | C4.1 46.51,96.84 47.94,95.42 | v49.53,40.01 v49.53,34.93 | v86.99,22.87 R103.2 | R1.2 83.18,95.1
  Top 0.406: IC4.14 49.37,97.32 47.94,95.89 47.94,95.42 47.94,91.92 47.78,91.76
  Top 0.813: 25.55,61.12 24.12,62.55 C1.1 21.43,61.12 17.46,61.12 15.87,59.54 15.87,57.79 17.3,56.36 IC2.2 | 25.55,61.12 IC2.20 30.47,58.9 31.27,58.11 v31.27,36.04 | v21.11,15.09 21.11,26.52 21.74,26.52 | 21.74,26.52 IC3.16 | C2.1 21.74,26.52 | 21.9,30.65 25.39,34.14 25.39,35.88 IC2.11 | IC36.20 QG3.14 QG3.1 38.89,17.94 IC35.16 | C138.1 73.18,26.04 IC1.14 | 75.72,83.19 IC50.14 73.34,75.73 71.27,73.67 C133.1 74.92,73.19 78.26,69.86 IC50.2 78.26,61.28 78.73,60.81 79.85,60.81 C5.1 | IC37.1 IC37.14 75.56,92.87 77.78,95.1 83.18,95.1 102.86,95.1 104.29,93.67 | IC49.20 107.31,90.81 C132.1 | C89.- 136.2,48.74 134.46,50.49 | v130.65,35.41 130.17,34.93 130.17,25.09 129.22,24.14 IC32.16 127.79,26.36 126.2,27.95 C135.1 123.66,29.53 120.49,29.53 118.42,27.47 112.39,27.47 108.9,23.98 108.9,6.99 107.31,5.4 62.7,5.4 60.32,7.79 v60.32,9.05 | C134.1 126.36,54.46 127.95,52.87 IC31.16 134.46,50.49 | R102.2 139.85,55.89 134.46,50.49 | 115.09,88.59 117.79,91.29 IC34.14 | C124.1 115.25,88.59 116.83,87 116.83,77.16 | 116.83,77.16 C131.1 115.25,74.62 117.47,72.4 RN8.1 117.47,60.49 | 116.83,77.16 119.53,77.16 IC48.14 | 125.57,54.77 124.61,55.73 122.23,55.73 117.47,60.49 | 25.55,61.12 25.55,86.84 30.95,92.24 v47.78,92.24 47.78,91.76 C92.1 | 117.47,60.49 v117.47,51.92 117.47,40.17 113.18,35.88 113.18,27.63 | P4.C2 10,13.18 8.09,11.28 8.09,10.17 10.16,8.1 10.47,8.1 C3.+ | IC33.14 84.45,35.09 IC33.43 | IC33.44 v89.53,47.63 C139.1 89.53,52.08 89.05,52.55 88.89,52.55 v88.89,60.49
  Bottom 0.305: IC37.1 IC37.2 79.69,81.76 79.85,81.76 80.8,80.81 88.42,80.81 IC50.9 | 113.66,89.38 C124.1 | IC36.24 50.64,41.12 v49.53,40.01 | v49.53,34.93 49.53,33.98 49.05,33.5 | IC33.14 81.59,35.09 | IC1.14 86.83,22.71 v86.99,22.87
  Bottom 0.61: 81.59,35.09 80.32,33.82 75.56,33.82 73.02,36.36 69.21,36.36 68.26,37.31 68.26,39.06 66.19,41.12 IC36.24
  Bottom 0.813: P4.C2 P4.C3 13.81,15.72 14.44,15.09 v21.11,15.09 21.11,7.79 22.7,6.2 33.33,6.2 33.49,6.04 36.51,6.04 37.3,6.83 37.3,7.79 C136.1 37.62,12.87 IC35.16 38.89,10.8 40.64,9.05 v60.32,9.05 | IC36.20 49.05,33.5 51.27,33.5 52.7,32.07 60.48,32.07 61.59,33.19 63.34,33.19 66.03,30.49 68.73,30.49 C138.1 71.75,28.42 | IC2.11 v31.27,36.04 | IC3.16 32.86,26.52 C137.1 37.78,24.45 QG3.14 | C92.1 68.57,87.16 69.69,88.27 C93.1 71.11,88.91 73.18,90.97 IC37.14 74.29,92.24 v47.78,92.24 | v130.65,35.41 135.25,35.41 C89.- | IC49.20 113.66,89.38 | IC33.44 IC33.43 | v88.89,60.49 85.56,60.49 85.08,61.12 IC5.14 C5.1 | v89.53,47.63 107.94,47.63 112.39,52.08 117.31,52.08 v117.47,51.92

### Text on the board
Top: CSA-IECUART-V1.1A | (C) A. Fachat
tNames: CSA-IECUART-V1.1A | (C) A. Fachat